# EAGLE schematic scoutfly_atmel (EAGLE 5.06)
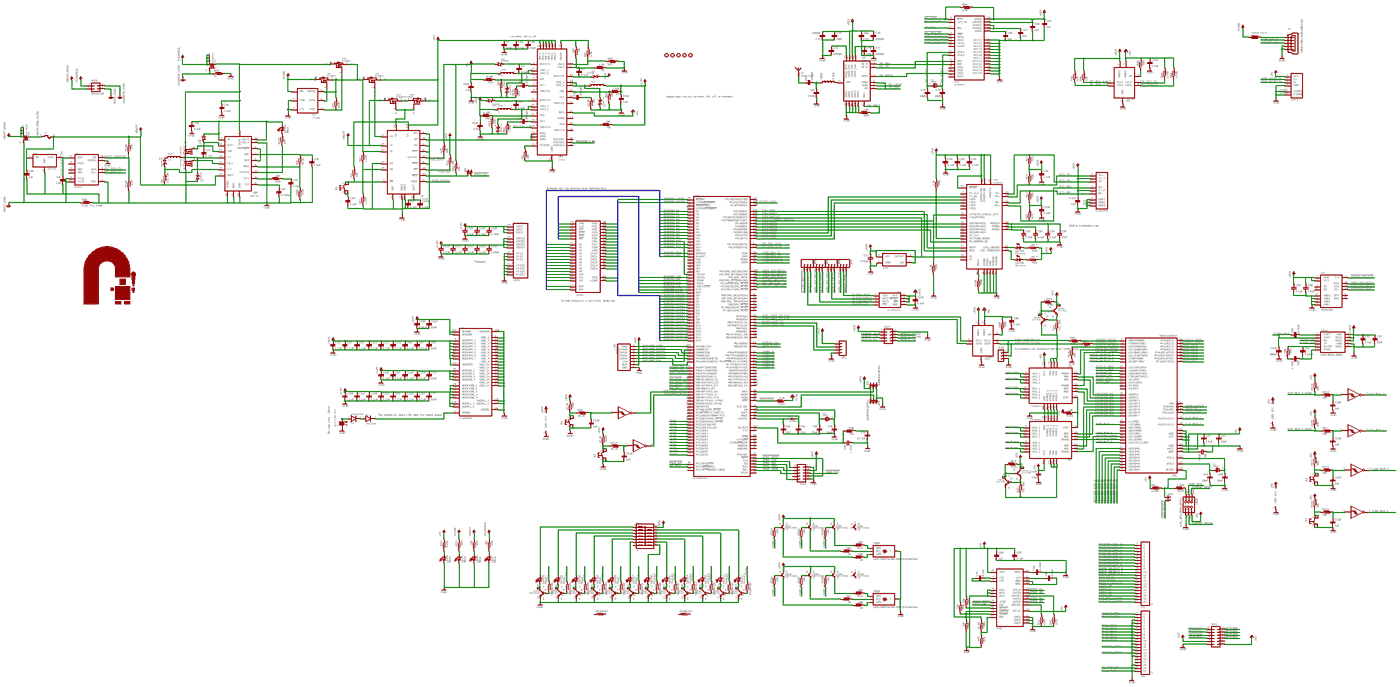
[diagram p0: schematic, sheet 1, overview]
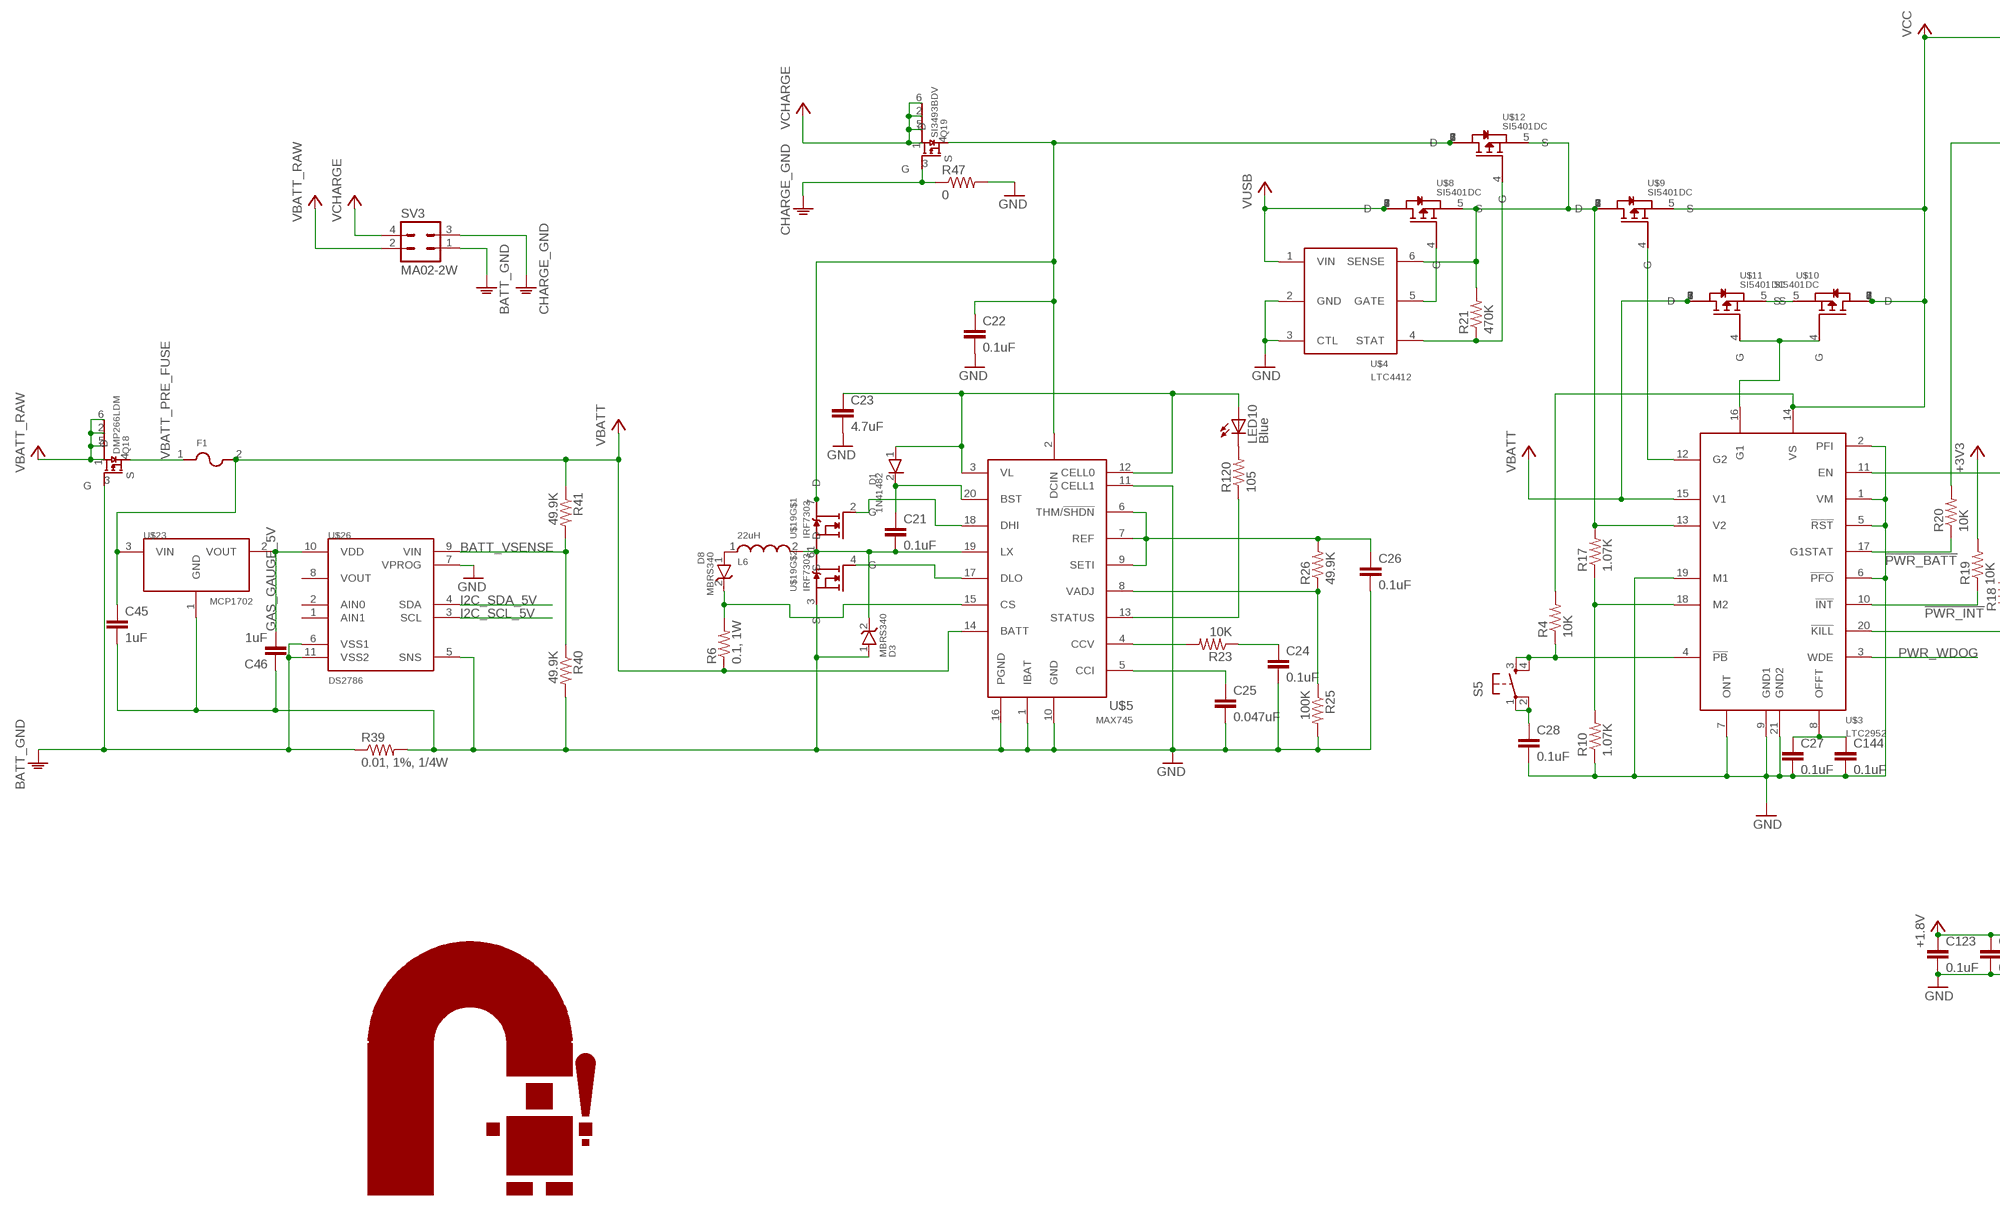
[diagram p1: schematic, sheet 1, part 1 of 6]
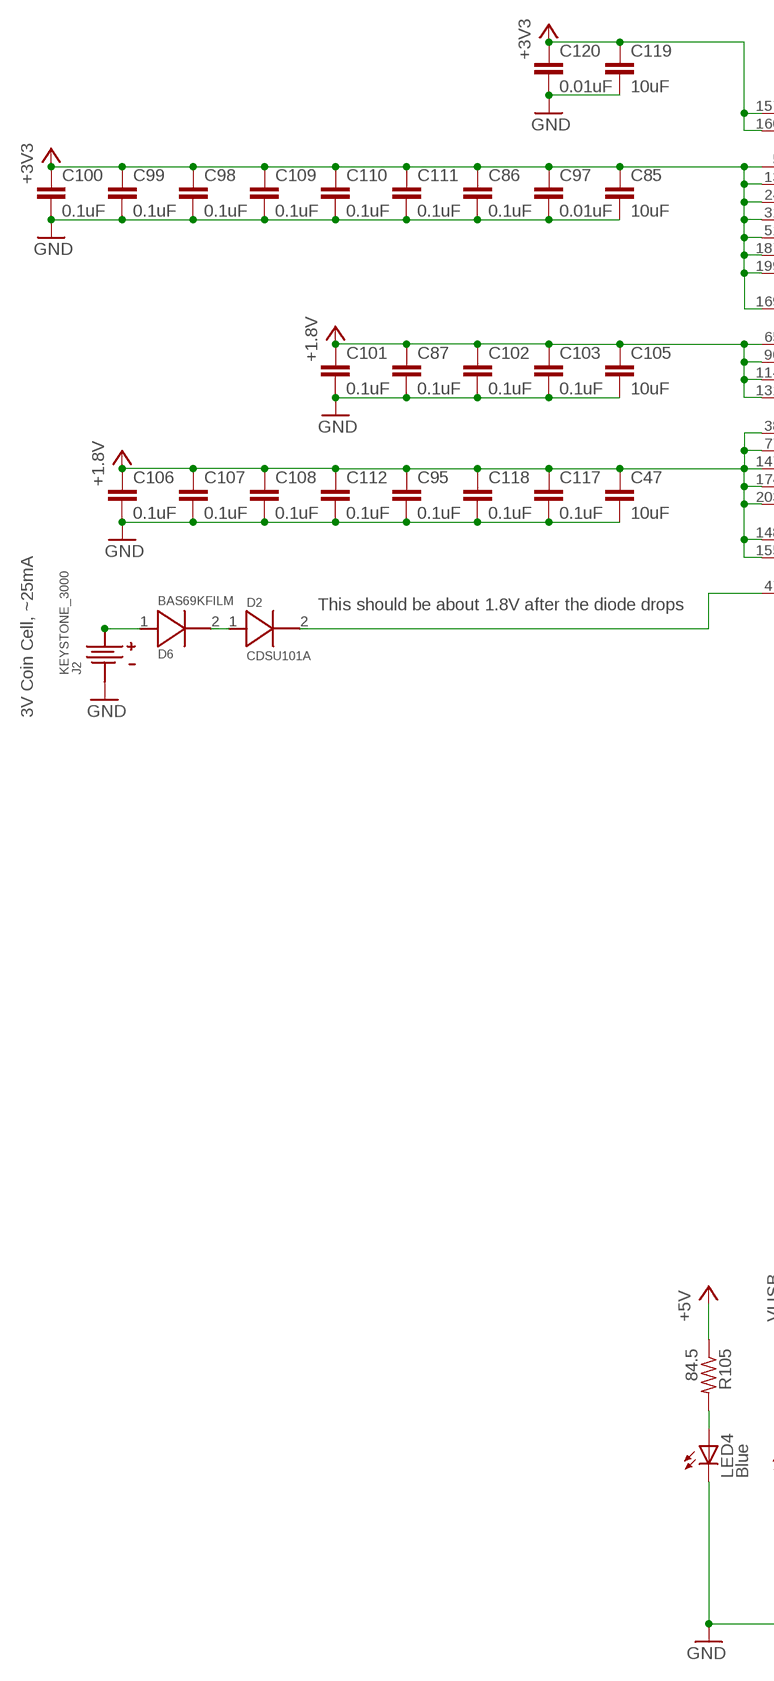
[diagram p2: schematic, sheet 1, part 2 of 6]
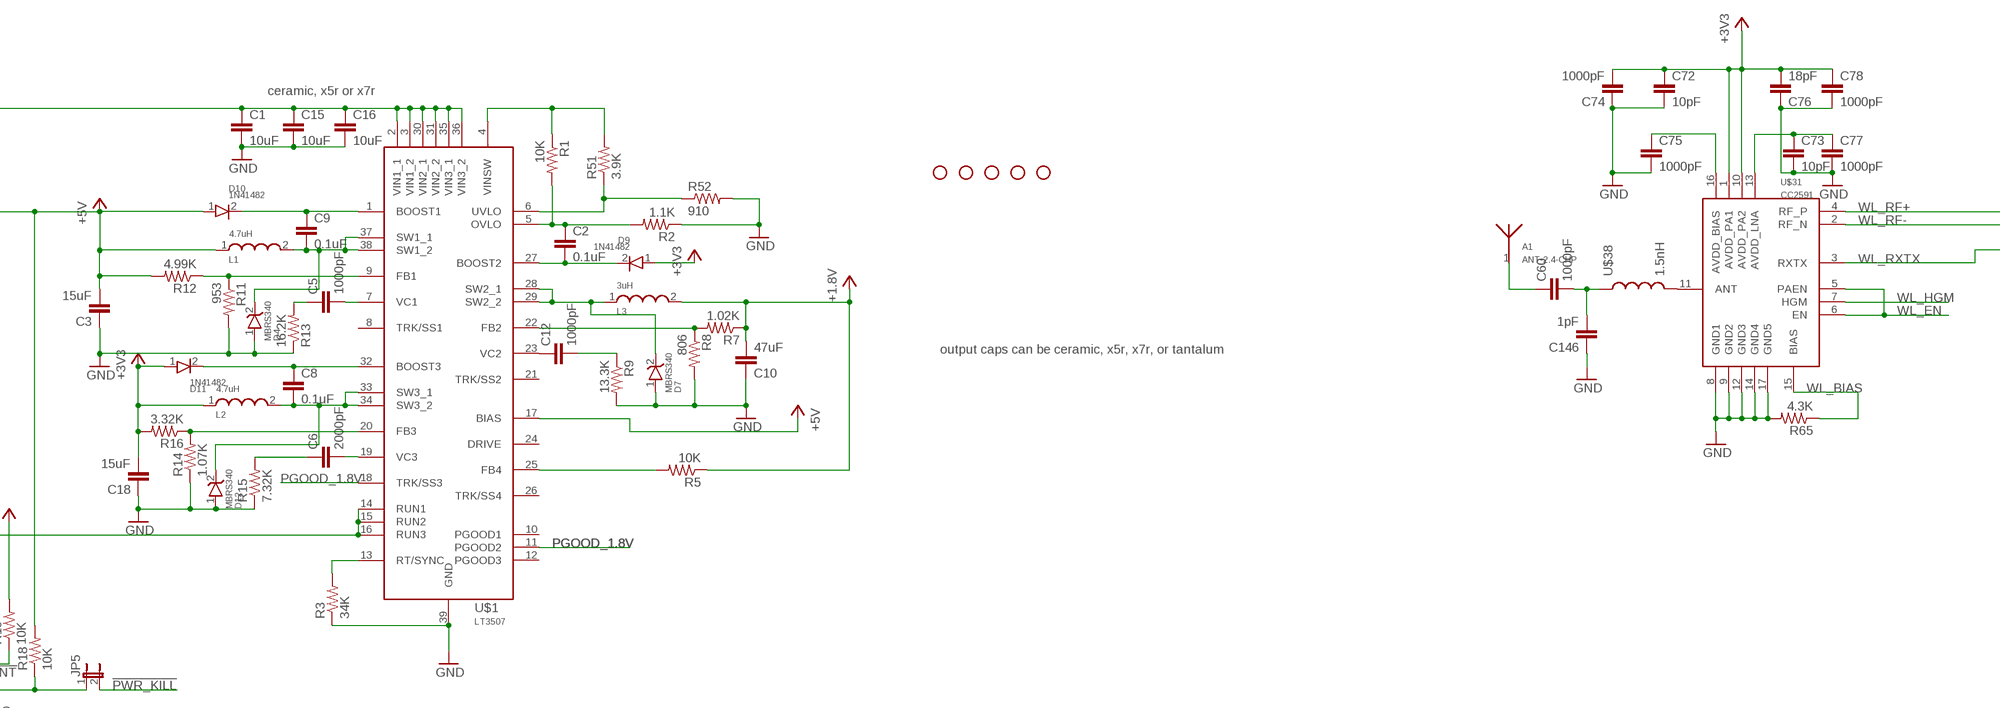
[diagram p3: schematic, sheet 1, part 3 of 6]
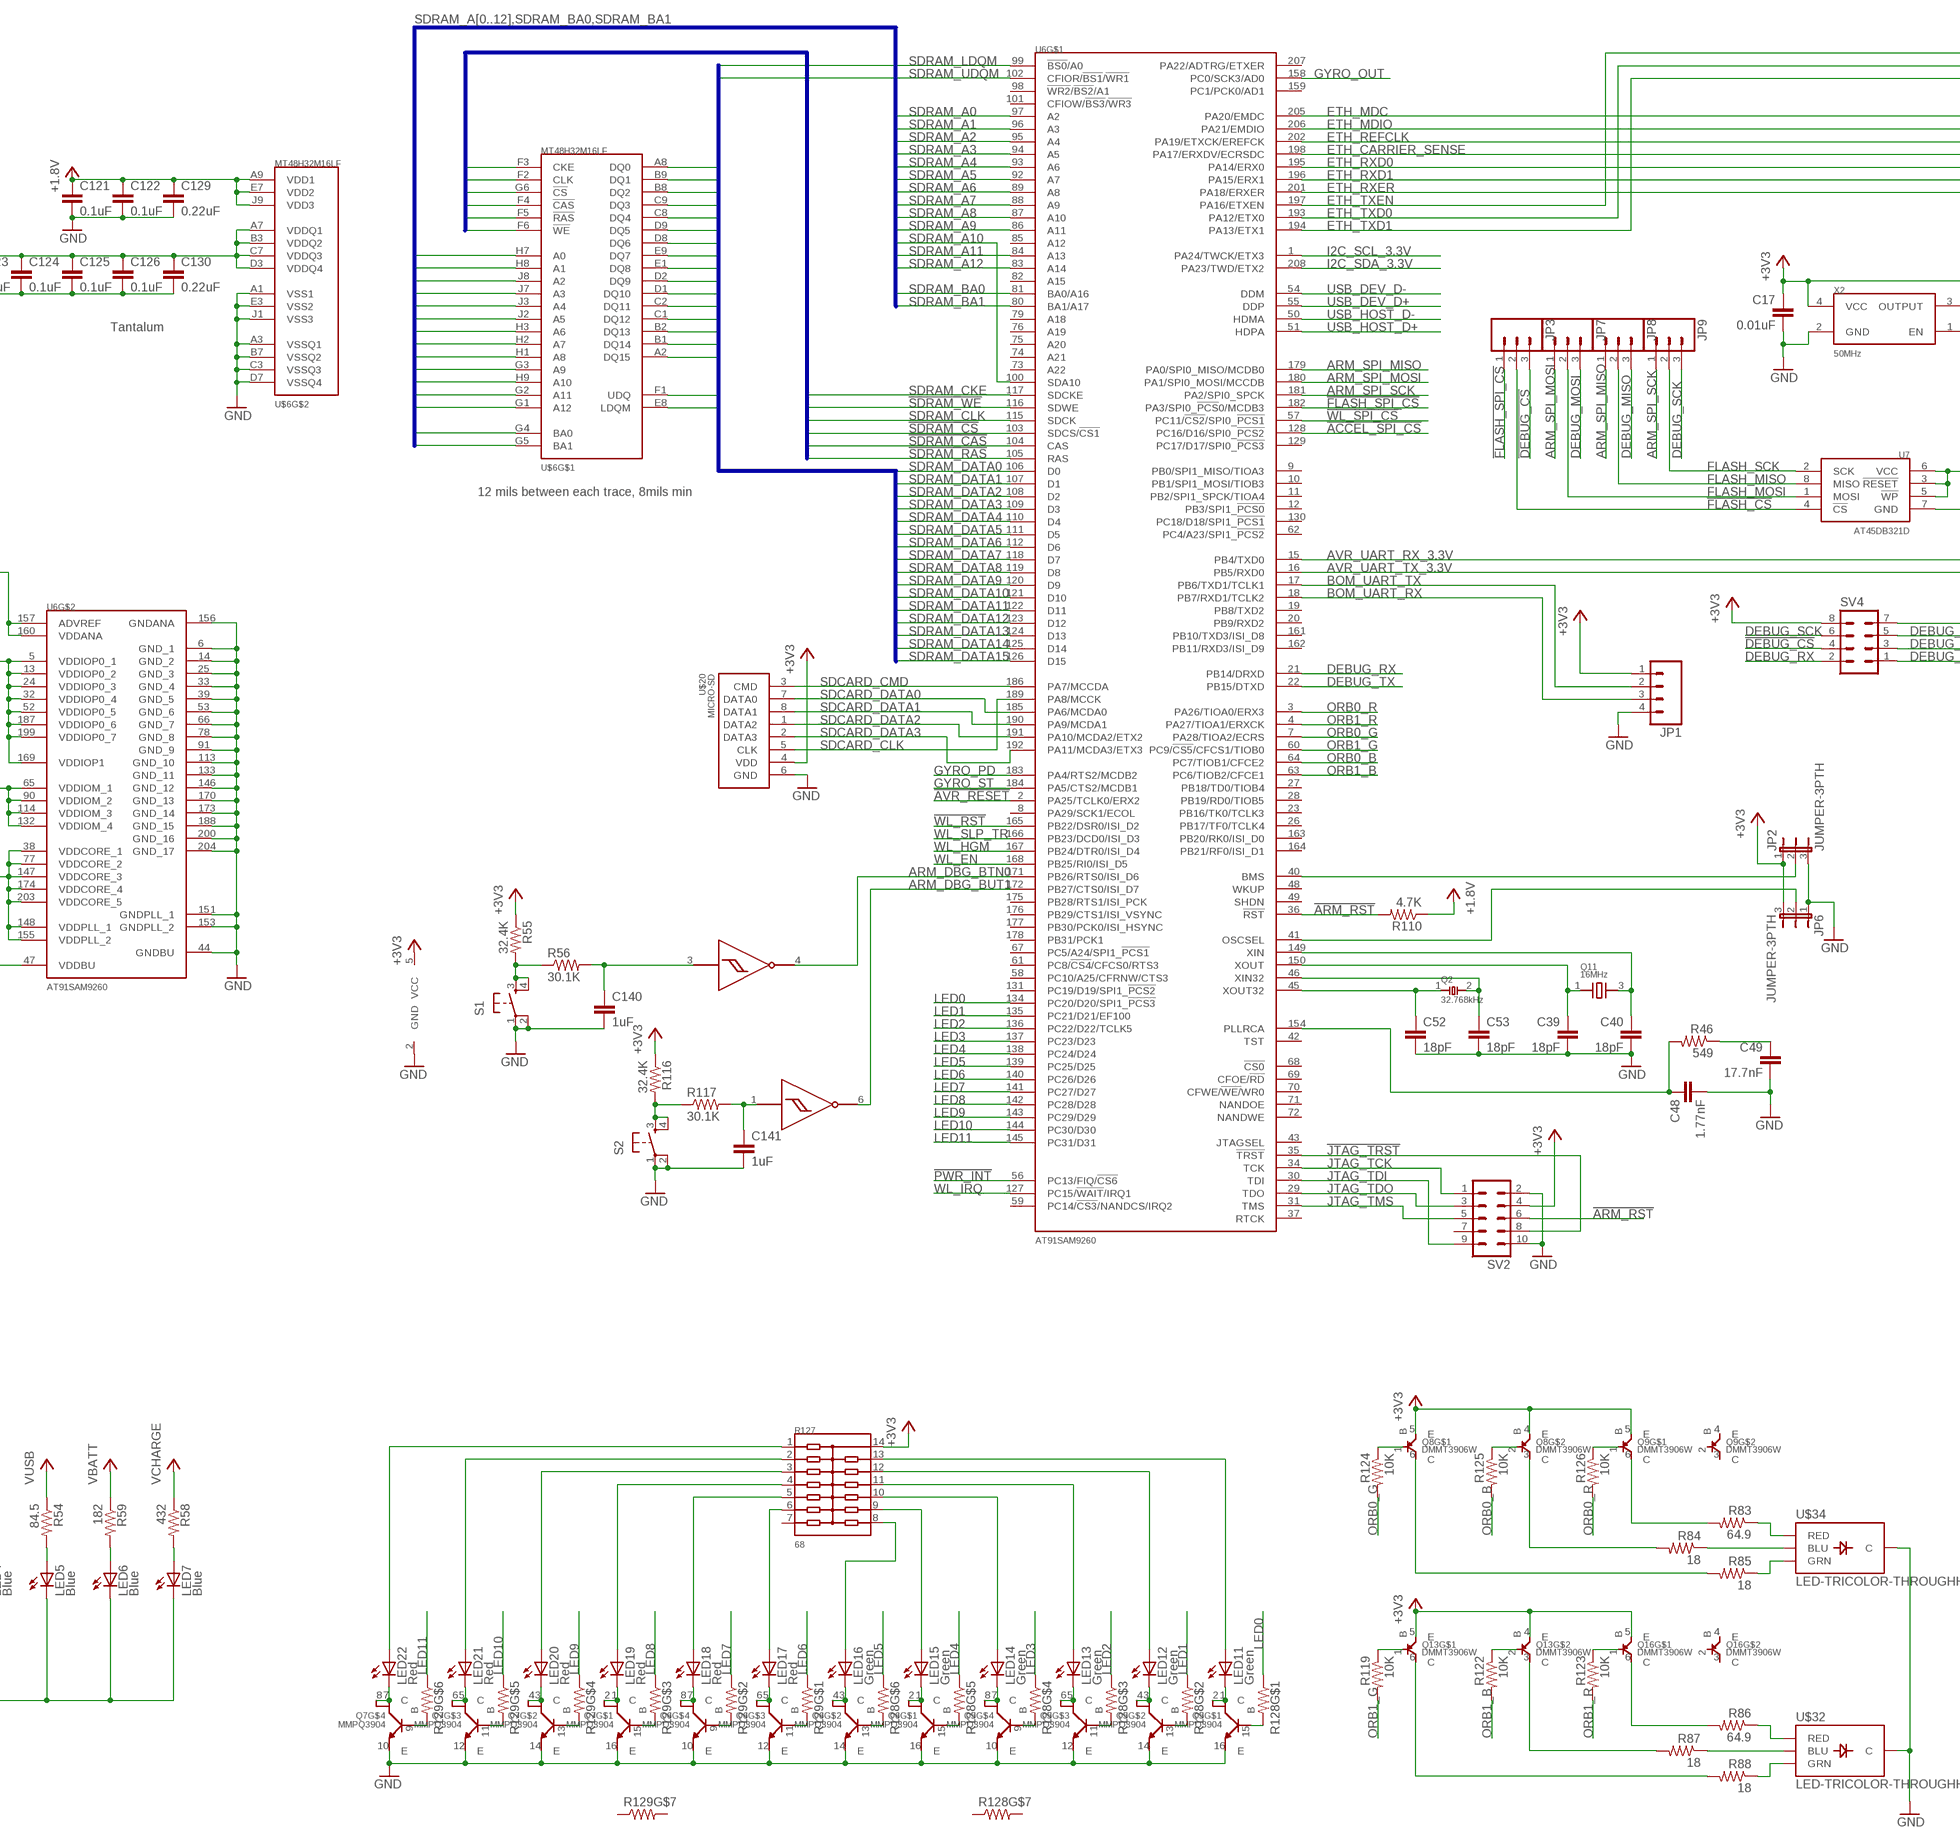
[diagram p4: schematic, sheet 1, part 4 of 6]
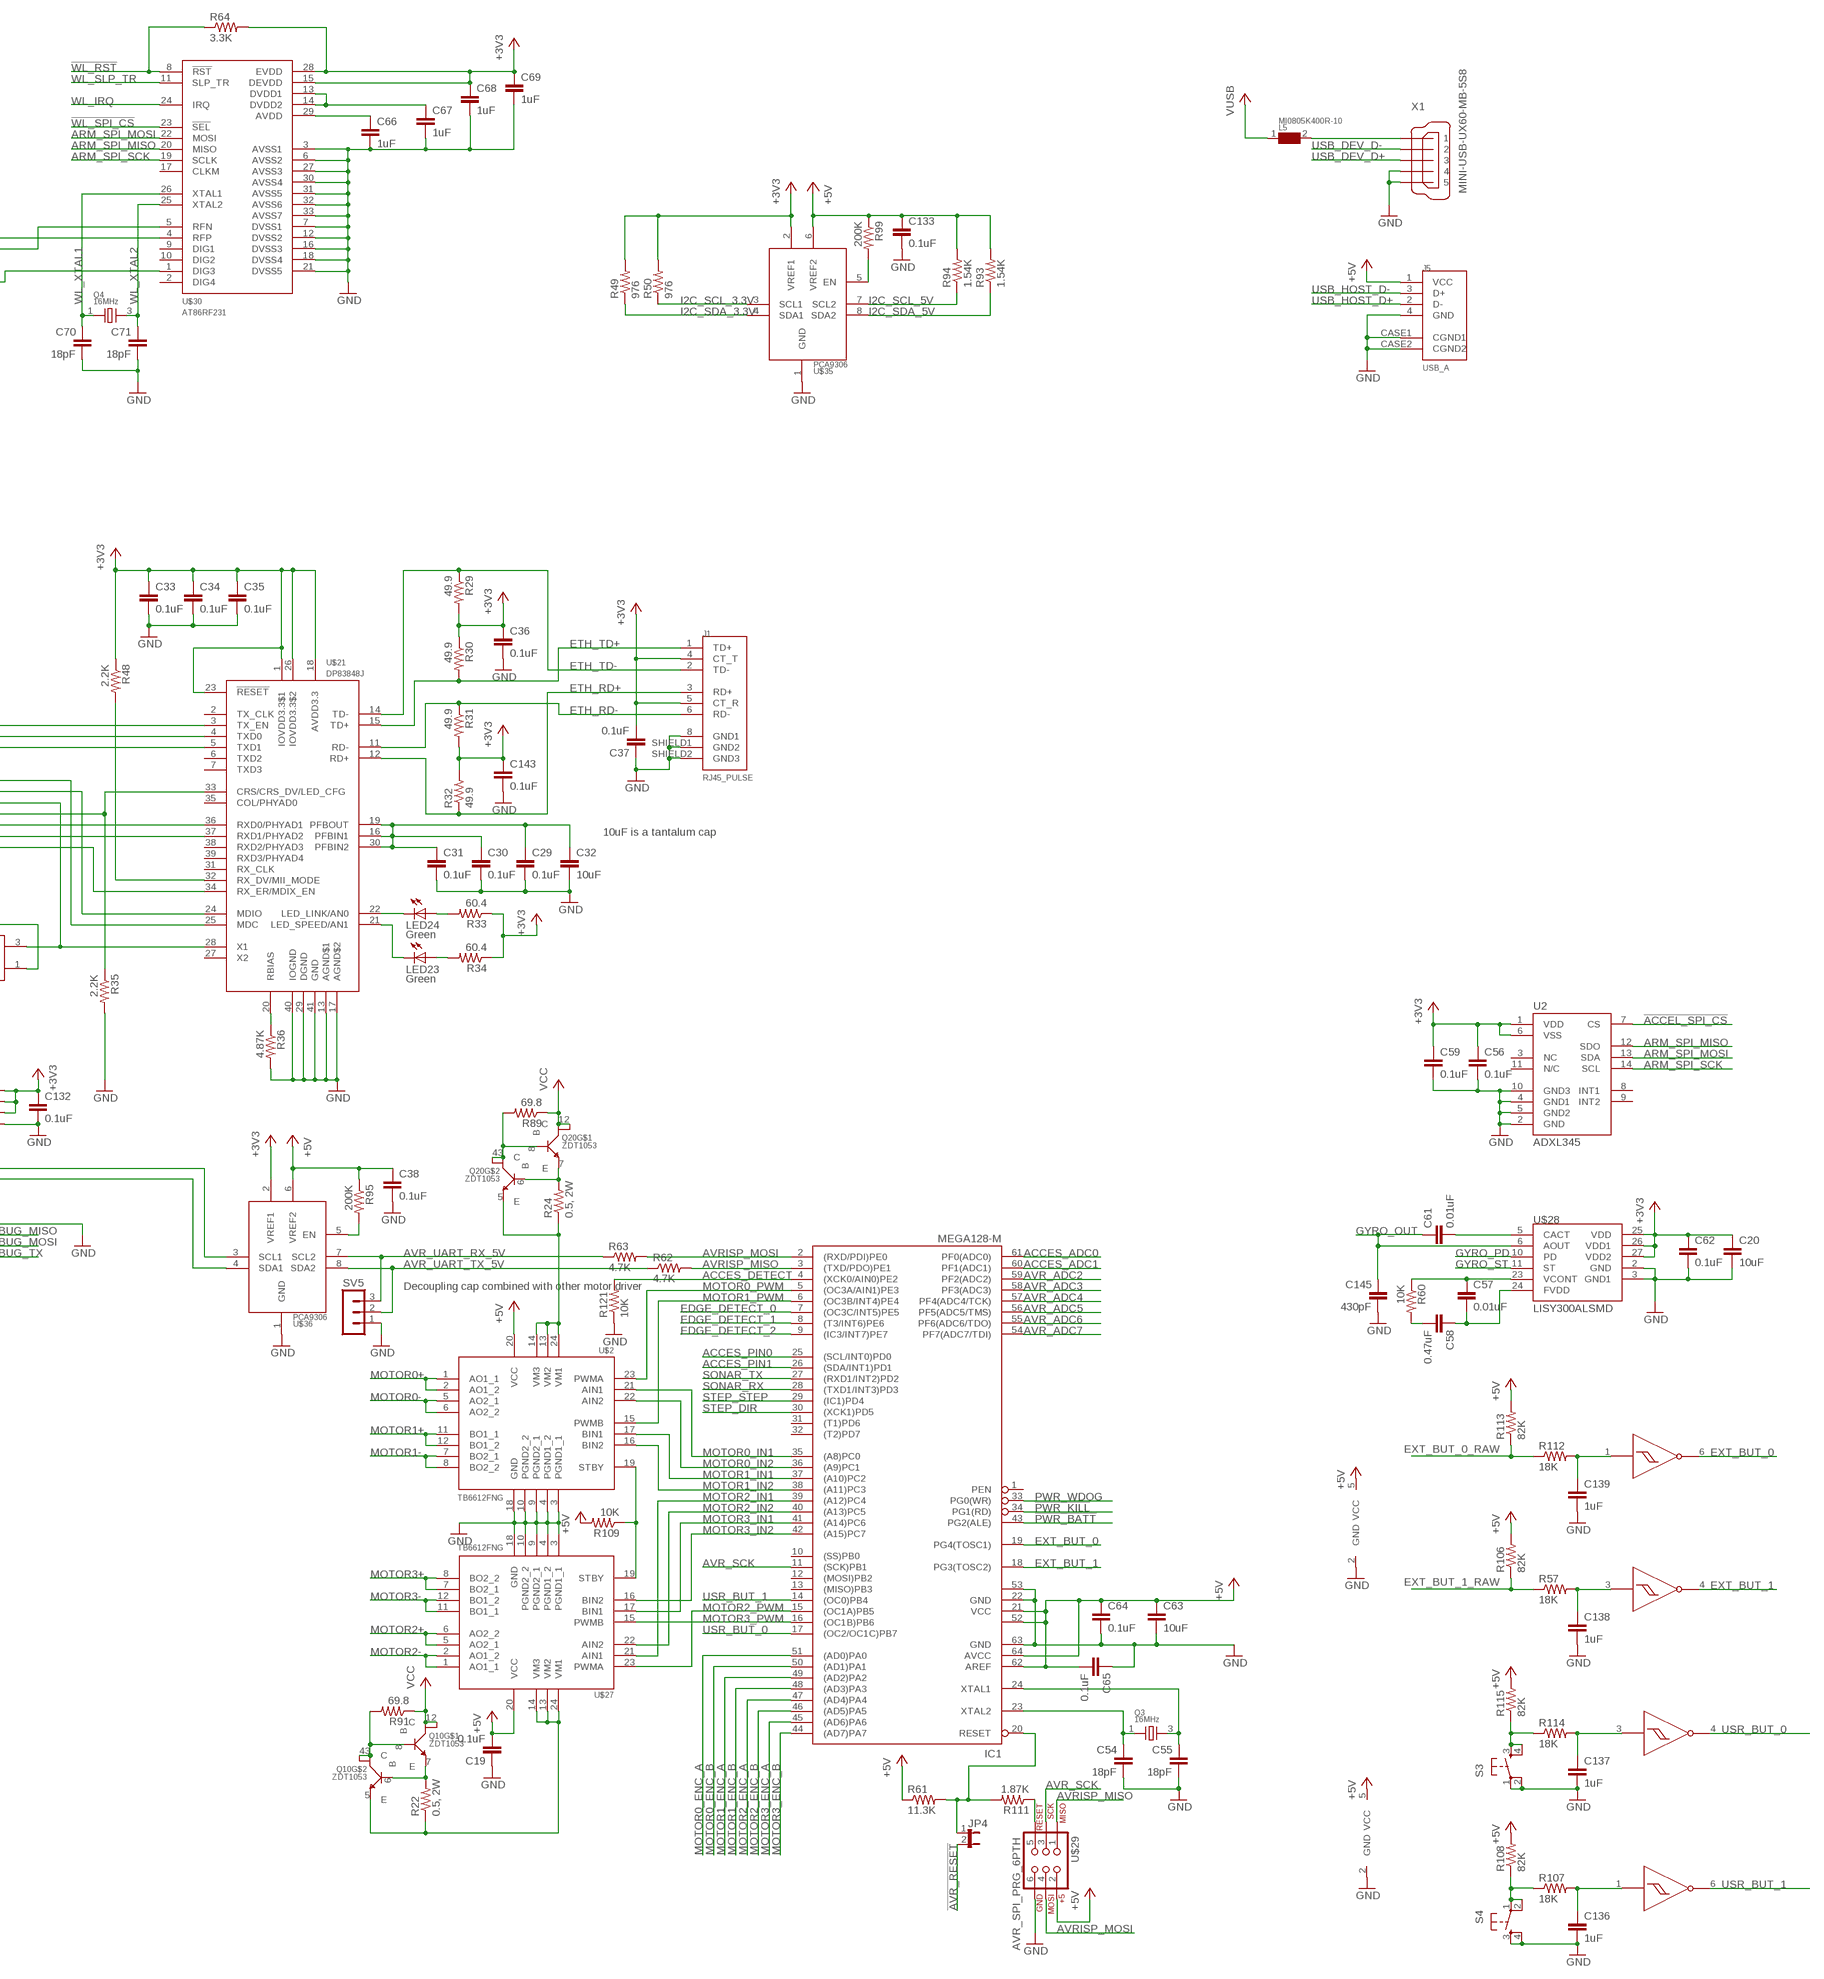
[diagram p5: schematic, sheet 1, part 5 of 6]
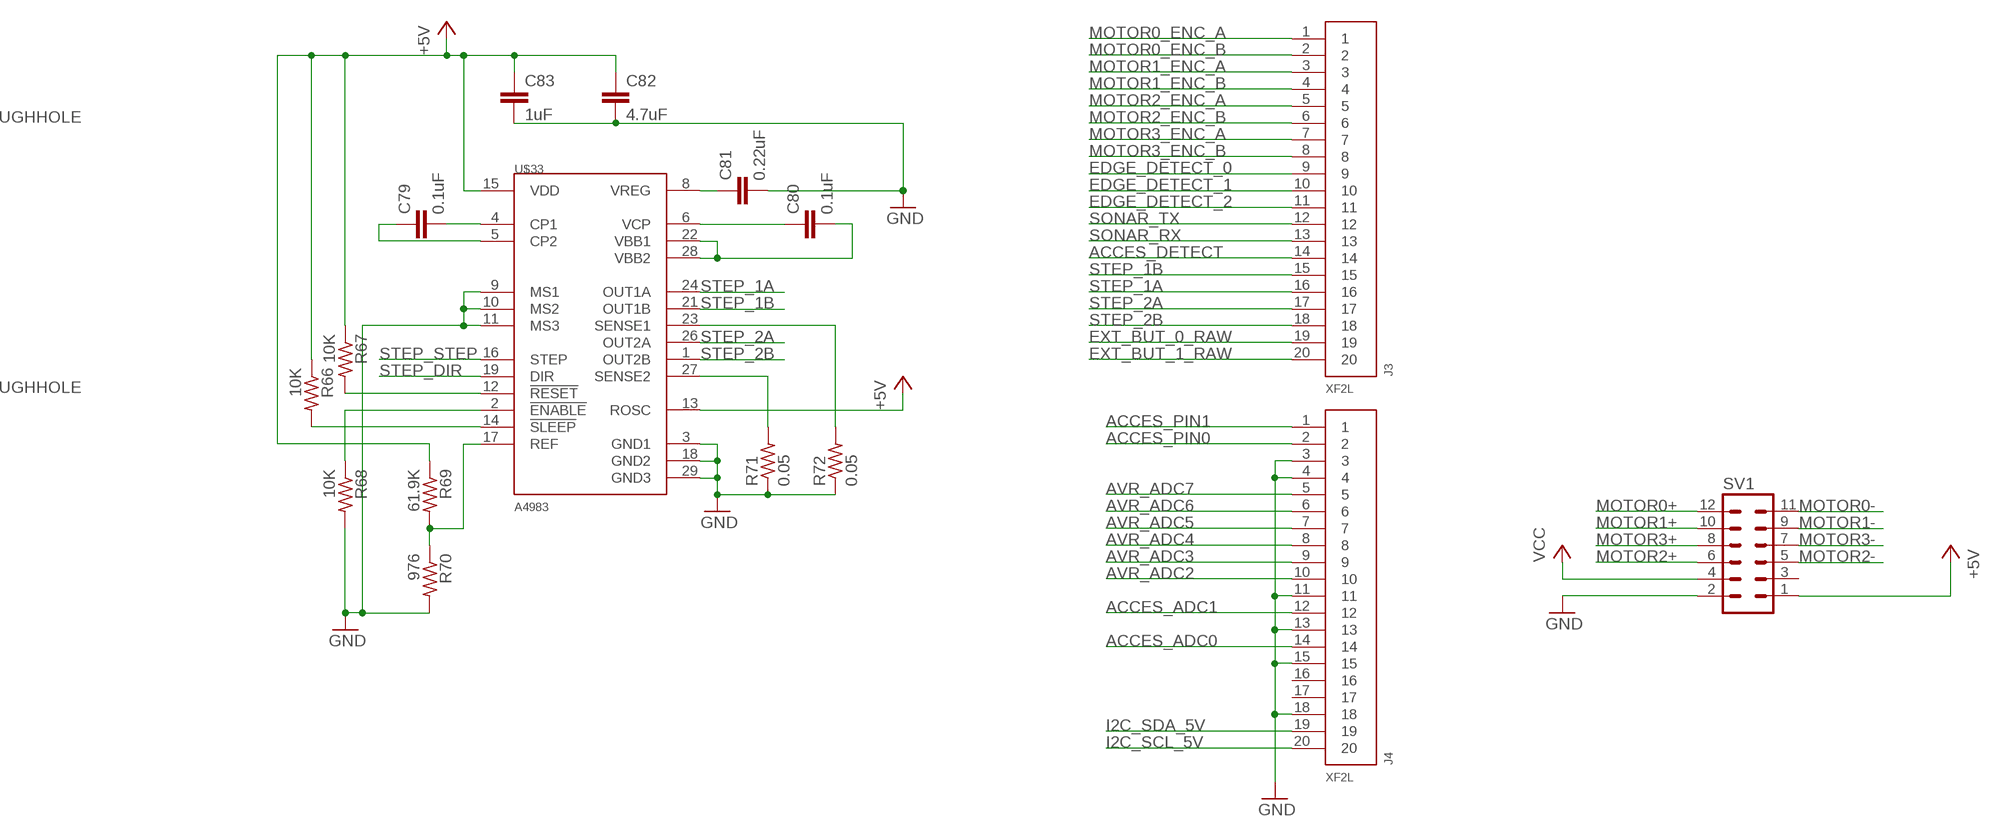
[diagram p6: schematic, sheet 1, part 6 of 6]

## Parts
A1  ANT-2.4-CHP  [CHIP_ANT_2.4GHZ]
C1  10uF  CAP0805  [0805]
C2  0.1uF  CAP0603-CAP  [0603-CAP]
C3  15uF  C-EUC1206  [C1206]
C5  1000pF  CAP0603-CAP  [0603-CAP]
C6  2000pF  CAP0603-CAP  [0603-CAP]
C8  0.1uF  CAP0603-CAP  [0603-CAP]
C9  0.1uF  CAP0603-CAP  [0603-CAP]
C10  47uF  C-EUC1206  [C1206]
C12  1000pF  CAP0603-CAP  [0603-CAP]
C15  10uF  CAP0805  [0805]
C16  10uF  CAP0805  [0805]
C17  0.01uF  CAP0603-CAP  [0603-CAP]
C18  15uF  C-EUC1206  [C1206]
C19  0.1uF  CAP0603-CAP  [0603-CAP]
C20  10uF  CAP0805  [0805]
C21  0.1uF  CAP0603-CAP  [0603-CAP]
C22  0.1uF  CAP0603-CAP  [0603-CAP]
C23  4.7uF  CAP0805  [0805]
C24  0.1uF  CAP0603-CAP  [0603-CAP]
C25  0.047uF  CAP0603-CAP  [0603-CAP]
C26  0.1uF  CAP0603-CAP  [0603-CAP]
C27  0.1uF  CAP0603-CAP  [0603-CAP]
C28  0.1uF  CAP0603-CAP  [0603-CAP]
C29  0.1uF  CAP0603-CAP  [0603-CAP]
C30  0.1uF  CAP0603-CAP  [0603-CAP]
C31  0.1uF  CAP0603-CAP  [0603-CAP]
C32  10uF  C-EUC1206  [C1206]
C33  0.1uF  CAP0603-CAP  [0603-CAP]
C34  0.1uF  CAP0603-CAP  [0603-CAP]
C35  0.1uF  CAP0603-CAP  [0603-CAP]
C36  0.1uF  CAP0603-CAP  [0603-CAP]
C37  0.1uF  CAP0603-CAP  [0603-CAP]
C38  0.1uF  CAP0603-CAP  [0603-CAP]
C39  18pF  CAP0603-CAP  [0603-CAP]
C40  18pF  CAP0603-CAP  [0603-CAP]
C45  1uF  CAP0603-CAP  [0603-CAP]
C46  1uF  CAP0603-CAP  [0603-CAP]
C47  10uF  CAP0805  [0805]
C48  1.77nF  C-EUC0805  [C0805]
C49  17.7nF  C-EUC0805  [C0805]
C52  18pF  CAP0603-CAP  [0603-CAP]
C53  18pF  CAP0603-CAP  [0603-CAP]
C54  18pF  CAP0603-CAP  [0603-CAP]
C55  18pF  CAP0603-CAP  [0603-CAP]
C56  0.1uF  CAP0603-CAP  [0603-CAP]
C57  0.01uF  CAP0603-CAP  [0603-CAP]
C58  0.47uF  CAP0603-CAP  [0603-CAP]
C59  0.1uF  CAP0603-CAP  [0603-CAP]
C60  1000pF  CAP0603-CAP  [0603-CAP]
C61  0.01uF  CAP0603-CAP  [0603-CAP]
C62  0.1uF  CAP0603-CAP  [0603-CAP]
C63  10uF  CAP0805  [0805]
C64  0.1uF  CAP0603-CAP  [0603-CAP]
C65  0.1uF  CAP0603-CAP  [0603-CAP]
C66  1uF  CAP0603-CAP  [0603-CAP]
C67  1uF  CAP0603-CAP  [0603-CAP]
C68  1uF  CAP0603-CAP  [0603-CAP]
C69  1uF  CAP0603-CAP  [0603-CAP]
C70  18pF  CAP0603-CAP  [0603-CAP]
C71  18pF  CAP0603-CAP  [0603-CAP]
C72  10pF  CAP0603-CAP  [0603-CAP]
C73  10pF  CAP0603-CAP  [0603-CAP]
C74  1000pF  CAP0603-CAP  [0603-CAP]
C75  1000pF  CAP0603-CAP  [0603-CAP]
C76  18pF  CAP0603-CAP  [0603-CAP]
C77  1000pF  CAP0603-CAP  [0603-CAP]
C78  1000pF  CAP0603-CAP  [0603-CAP]
C79  0.1uF  CAP0603-CAP  [0603-CAP]
C80  0.1uF  CAP0603-CAP  [0603-CAP]
C81  0.22uF  CAP0603-CAP  [0603-CAP]
C82  4.7uF  C-EUC0805  [C0805]
C83  1uF  CAP0603-CAP  [0603-CAP]
C85  10uF  CAP0805  [0805]
C86  0.1uF  CAP0603-CAP  [0603-CAP]
C87  0.1uF  CAP0603-CAP  [0603-CAP]
C95  0.1uF  CAP0603-CAP  [0603-CAP]
C97  0.01uF  CAP0603-CAP  [0603-CAP]
C98  0.1uF  CAP0603-CAP  [0603-CAP]
C99  0.1uF  CAP0603-CAP  [0603-CAP]
C100  0.1uF  CAP0603-CAP  [0603-CAP]
C101  0.1uF  CAP0603-CAP  [0603-CAP]
C102  0.1uF  CAP0603-CAP  [0603-CAP]
C103  0.1uF  CAP0603-CAP  [0603-CAP]
C105  10uF  CAP0805  [0805]
C106  0.1uF  CAP0603-CAP  [0603-CAP]
C107  0.1uF  CAP0603-CAP  [0603-CAP]
C108  0.1uF  CAP0603-CAP  [0603-CAP]
C109  0.1uF  CAP0603-CAP  [0603-CAP]
C110  0.1uF  CAP0603-CAP  [0603-CAP]
C111  0.1uF  CAP0603-CAP  [0603-CAP]
C112  0.1uF  CAP0603-CAP  [0603-CAP]
C117  0.1uF  CAP0603-CAP  [0603-CAP]
C118  0.1uF  CAP0603-CAP  [0603-CAP]
C119  10uF  CAP0805  [0805]
C120  0.01uF  CAP0603-CAP  [0603-CAP]
C121  0.1uF  C-EUC1206  [C1206]
C122  0.1uF  C-EUC1206  [C1206]
C123  0.1uF  C-EUC1206  [C1206]
C124  0.1uF  C-EUC1206  [C1206]
C125  0.1uF  C-EUC1206  [C1206]
C126  0.1uF  C-EUC1206  [C1206]
C129  0.22uF  C-EUC1206  [C1206]
C130  0.22uF  C-EUC1206  [C1206]
C132  0.1uF  CAP0603-CAP  [0603-CAP]
C133  0.1uF  CAP0603-CAP  [0603-CAP]
C136  1uF  CAP0603-CAP  [0603-CAP]
C137  1uF  CAP0603-CAP  [0603-CAP]
C138  1uF  CAP0603-CAP  [0603-CAP]
C139  1uF  CAP0603-CAP  [0603-CAP]
C140  1uF  CAP0603-CAP  [0603-CAP]
C141  1uF  CAP0603-CAP  [0603-CAP]
C143  0.1uF  CAP0603-CAP  [0603-CAP]
C144  0.1uF  CAP0603-CAP  [0603-CAP]
C145  430pF  CAP0603-CAP  [0603-CAP]
C146  1pF  CAP0603-CAP  [0603-CAP]
D1  1N41482  [SOD-123]
D2  CDSU101A  DIODE  [0603]
D3  MBRS340  [SMC/DO-214AB]
D4  MBRS340  [SMC/DO-214AB]
D6  BAS69KFILM  [SOD523]
D7  MBRS340  [SMC/DO-214AB]
D8  MBRS340  [SMC/DO-214AB]
D9  1N41482  [SOD-123]
D10  1N41482  [SOD-123]
D11  1N41482  [SOD-123]
D12  MBRS340  [SMC/DO-214AB]
F1  MF-SM200  [SM200]
IC1  MEGA128-M  [MLF64]
J1  RJ45_PULSE  [RJ45-PULSE]
J2  KEYSTONE_3000  [COIN_CELL]
J3  XF2L  [OMRON_XF]
J4  XF2L  [OMRON_XF]
J5  USB_A  [USB_A]
JP1  M04PTH  [1X04]
JP2  JUMPER-3PTH  [1X03]
JP3  M03PTH  [1X03]
JP4  JUMPER-2PTH  [1X02]
JP5  JUMPER-2PTH  [1X02]
JP6  JUMPER-3PTH  [1X03]
JP7  M03PTH  [1X03]
JP8  M03PTH  [1X03]
JP9  M03PTH  [1X03]
JP10  STAND-OFF  [STAND-OFF]
JP11  STAND-OFF  [STAND-OFF]
JP12  STAND-OFF  [STAND-OFF]
JP13  STAND-OFF  [STAND-OFF]
JP14  STAND-OFF  [STAND-OFF]
L1  4.7uH  DR74-XXX-R  [DR74]
L2  4.7uH  DR74-XXX-R  [DR74]
L3  3uH  NR6045TXXX  [NR6045]
L5  MI0805K400R-10  [0805]
L6  22uH  DR125-XXX-R  [DR125]
LED4  Blue  LED0603  [LED-0603]
LED5  Blue  LED0603  [LED-0603]
LED6  Blue  LED0603  [LED-0603]
LED7  Blue  LED0603  [LED-0603]
LED10  Blue  LED0603  [LED-0603]
LED11  Green  LED0603  [LED-0603]
LED12  Green  LED0603  [LED-0603]
LED13  Green  LED0603  [LED-0603]
LED14  Green  LED0603  [LED-0603]
LED15  Green  LED0603  [LED-0603]
LED16  Green  LED0603  [LED-0603]
LED17  Red  LED0603  [LED-0603]
LED18  Red  LED0603  [LED-0603]
LED19  Red  LED0603  [LED-0603]
LED20  Red  LED0603  [LED-0603]
LED21  Red  LED0603  [LED-0603]
LED22  Red  LED0603  [LED-0603]
LED23  Green  LED0603  [LED-0603]
LED24  Green  LED0603  [LED-0603]
Q2  32.768kHz  ECX-31B  [ECX-31B]
Q3  16MHz  NX3225SA  [NX3225SA]
Q4  16MHz  NX3225SA  [NX3225SA]
Q5  MMPQ3904  [16-SOIC]
Q6  MMPQ3904  [16-SOIC]
Q7  MMPQ3904  [16-SOIC]
Q8  DMMT3906W  [SOT363]
Q9  DMMT3906W  [SOT363]
Q10  ZDT1053  [SOT223-8]
Q11  16MHz  NX3225SA  [NX3225SA]
Q13  DMMT3906W  [SOT363]
Q16  DMMT3906W  [SOT363]
Q18  DMP266LDM  [SOT26]
Q19  SI3493BDV  [6-TSOP]
Q20  ZDT1053  [SOT223-8]
R1  10K  R-US_R0603  [R0603]
R2  1.1K  R-US_R0603  [R0603]
R3  34K  R-US_R0603  [R0603]
R4  10K  R-US_R0603  [R0603]
R5  10K  R-US_R0603  [R0603]
R6  0.1, 1W  RESISTOR2010  [R2010]
R7  1.02K  R-US_R0603  [R0603]
R8  806  R-US_R0603  [R0603]
R9  13.3K  R-US_R0603  [R0603]
R10  1.07K  R-US_R0603  [R0603]
R11  953  R-US_R0603  [R0603]
R12  4.99K  R-US_R0603  [R0603]
R13  16.2K  R-US_R0603  [R0603]
R14  1.07K  R-US_R0603  [R0603]
R15  7.32K  R-US_R0603  [R0603]
R16  3.32K  R-US_R0603  [R0603]
R17  1.07K  R-US_R0603  [R0603]
R18  10K  R-US_R0603  [R0603]
R19  10K  R-US_R0603  [R0603]
R20  10K  R-US_R0603  [R0603]
R21  470K  R-US_R0603  [R0603]
R22  0.5, 2W  R-US_R2512  [R2512]
R23  10K  R-US_R0603  [R0603]
R24  0.5, 2W  R-US_R2512  [R2512]
R25  100K  R-US_R0603  [R0603]
R26  49.9K  R-US_R0603  [R0603]
R29  49.9  R-US_R0603  [R0603]
R30  49.9  R-US_R0603  [R0603]
R31  49.9  R-US_R0603  [R0603]
R32  49.9  R-US_R0603  [R0603]
R33  60.4  R-US_R0603  [R0603]
R34  60.4  R-US_R0603  [R0603]
R35  2.2K  R-US_R0603  [R0603]
R36  4.87K  R-US_R0603  [R0603]
R39  0.01, 1%, 1/4W  RESISTOR  [0805]
R40  49.9K  R-US_R0603  [R0603]
R41  49.9K  R-US_R0603  [R0603]
R46  549  R-US_R0603  [R0603]
R47  0  R-US_R0603  [R0603]
R48  2.2K  R-US_R0603  [R0603]
R49  976  R-US_R0603  [R0603]
R50  976  R-US_R0603  [R0603]
R51  3.9K  R-US_R0603  [R0603]
R52  910  R-US_R0603  [R0603]
R54  84.5  R-US_R0603  [R0603]
R55  32.4K  R-US_R0603  [R0603]
R56  30.1K  R-US_R0603  [R0603]
R57  18K  R-US_R0603  [R0603]
R58  432  R-US_R0603  [R0603]
R59  182  R-US_R0603  [R0603]
R60  10K  R-US_R0603  [R0603]
R61  11.3K  R-US_R0603  [R0603]
R62  4.7K  R-US_R0603  [R0603]
R63  4.7K  R-US_R0603  [R0603]
R64  3.3K  R-US_R0603  [R0603]
R65  4.3K  R-US_R0603  [R0603]
R66  10K  R-US_R0603  [R0603]
R67  10K  R-US_R0603  [R0603]
R68  10K  R-US_R0603  [R0603]
R69  61.9K  R-US_R0603  [R0603]
R70  976  R-US_R0603  [R0603]
R71  0.05  R-US_R0603  [R0603]
R72  0.05  R-US_R0603  [R0603]
R83  64.9  R-US_R0603  [R0603]
R84  18  R-US_R0603  [R0603]
R85  18  R-US_R0603  [R0603]
R86  64.9  R-US_R0603  [R0603]
R87  18  R-US_R0603  [R0603]
R88  18  R-US_R0603  [R0603]
R89  69.8  R-US_R0603  [R0603]
R91  69.8  R-US_R0603  [R0603]
R93  1.54K  R-US_R0603  [R0603]
R94  1.54K  R-US_R0603  [R0603]
R95  200K  R-US_R0603  [R0603]
R99  200K  R-US_R0603  [R0603]
R105  84.5  R-US_R0603  [R0603]
R106  82K  R-US_R0603  [R0603]
R107  18K  R-US_R0603  [R0603]
R108  82K  R-US_R0603  [R0603]
R109  10K  R-US_R0603  [R0603]
R110  4.7K  R-US_R0603  [R0603]
R111  1.87K  R-US_R0603  [R0603]
R112  18K  R-US_R0603  [R0603]
R113  82K  R-US_R0603  [R0603]
R114  18K  R-US_R0603  [R0603]
R115  82K  R-US_R0603  [R0603]
R116  32.4K  R-US_R0603  [R0603]
R117  30.1K  R-US_R0603  [R0603]
R119  10K  R-US_R0603  [R0603]
R120  105  R-US_R0603  [R0603]
R121  10K  R-US_R0603  [R0603]
R122  10K  R-US_R0603  [R0603]
R123  10K  R-US_R0603  [R0603]
R124  10K  R-US_R0603  [R0603]
R125  10K  R-US_R0603  [R0603]
R126  10K  R-US_R0603  [R0603]
R127  68  RESNET_BUS_13  [14-SOIC_CTS]
R128  RESNET_ISO_7  [14-SOIC_CTS]
R129  RESNET_ISO_7  [14-SOIC_CTS]
S1  TAC_SWITCHSMD  [TACTILE_SWITCH_SMD]
S2  TAC_SWITCHSMD  [TACTILE_SWITCH_SMD]
S3  TAC_SWITCHSMD  [TACTILE_SWITCH_SMD]
S4  TAC_SWITCHSMD  [TACTILE_SWITCH_SMD]
S5  TAC_SWITCHSMD  [TACTILE_SWITCH_SMD]
SV1  MA06-2W  [MA06-2W]
SV2  MA05-2  [MA05-2]
SV3  MA02-2W  [MA02-2W]
SV4  MA04-2  [MA04-2]
SV5  MA03-1  [MA03-1]
U2  ADXL345  [LGA14]
U3  NL27WZ14  [SOT363]
U4  NL27WZ14  [SOT363]
U5  NL27WZ14  [SOT363]
U6  AT91SAM9260  [208-PQFP]
U7  AT45DB321D  [8-SOIC]
U$1  LT3507  [38-QFN]
U$2  TB6612FNG  [24-SSOP]
U$3  LTC2952  [20-QFN]
U$4  LTC4412  [6-TSOT23]
U$5  MAX745  [20-SSOP]
U$6  MT48H32M16LF  [54-VFBGA]
U$7  ROBOLOGOSILKSCREEN  [RCLOGO]
U$8  SI5401DC  [1206-8_CHIPFET]
U$9  SI5401DC  [1206-8_CHIPFET]
U$10  SI5401DC  [1206-8_CHIPFET]
U$11  SI5401DC  [1206-8_CHIPFET]
U$12  SI5401DC  [1206-8_CHIPFET]
U$19  IRF7303  [8-SOIC]
U$20  MICRO-SD  [MICRO_SD]
U$21  DP83848J  [40-LLP]
U$23  MCP1702  [SOT23]
U$26  DS2786  [10-TDFN]
U$27  TB6612FNG  [24-SSOP]
U$28  LISY300ALSMD  [LGA28]
U$29  AVR_SPI_PRG_6PTH  [2X3]
U$30  AT86RF231  [32-QFN]
U$31  CC2591  [16-QFN]
U$32  LED-TRICOLOR-THROUGHHOLE  [LED-TRICOLOR-THROUGHHOLE]
U$33  A4983  [28-QFN]
U$34  LED-TRICOLOR-THROUGHHOLE  [LED-TRICOLOR-THROUGHHOLE]
U$35  PCA9306  [TSSOP8]
U$36  PCA9306  [TSSOP8]
U$38  1.5nH  INDUCTOR0603  [0603]
X1  MINI-USB-UX60-MB-5S8  [UX60-MB-5S8]
X2  50MHz  K25-3C  [K25-3C]

## Nets
3.3V: C17.1 C18.2 C20.1 C33.1 C34.1 C35.1 C36.1 C37.2 C56.1 C59.1 C62.1 C68.1 C69.1 C72.1 C74.2 C76.2 C78.1 C85.1 C86.1 C97.1 C98.1 C99.1 C100.1 C109.1 C110.1 C111.1 C119.1 C120.1 C132.1 C143.1 D9.1 D11.1 J1.4(CT_T) J1.5(CT_R) JP1.1 JP2.1 JP6.3 L2.1 Q8.4(E) Q8.5(E) Q9.5(E) Q13.4(E) Q13.5(E) Q16.5(E) R16.2 R19.2 R29.2 R30.1 R31.2 R32.2 R33.1 R34.1 R48.1 R49.2 R50.2 R55.1 R64.2 R116.1 R127.14 SV2.4 SV4.8 U2.1(VDD) U2.6(VSS) U5.5(VCC) U6.5(VDDIOP0_1) U6.13(VDDIOP0_2) U6.24(VDDIOP0_3) U6.32(VDDIOP0_4) U6.52(VDDIOP0_5) U6.157(ADVREF) U6.160(VDDANA) U6.169(VDDIOP1) U6.187(VDDIOP0_6) U6.199(VDDIOP0_7) U7.3(!RESET) U7.5(!WP) U7.6(VCC) U$20.4(VDD) U$21.1(IOVDD3.3$1) U$21.18(AVDD3.3) U$21.23(!RESET) U$21.26(IOVDD3.3$2) U$28.25(VDD) U$28.26(VDD1) U$28.27(VDD2) U$30.15(DEVDD) U$30.28(EVDD) U$31.1(AVDD_PA1) U$31.10(AVDD_PA2) U$35.2(VREF1) U$36.2(VREF1) X2.1(EN) X2.4(VCC) ; supply symbol labelled +3V3
!ACCEL_SPI_CS: U2.7(CS) U6.128(PC16/D16/SPI0_!PCS2)
!ARM_RST: R110.2 SV2.6 U6.36(!RST)
!AVR_RESET: JP4.2 U6.2(PA25/TCLK0/ERX2)
!DEBUG_CS: JP3.3 SV4.4
!FLASH_CS: JP3.2 U7.4(!CS)
!FLASH_SPI_CS: JP3.1 U6.182(PA3/SPI0_!PCS!0/MCDB3)
!JTAG_TRST: SV2.8 U6.35(!TRST)
!PWR_BATT: IC1.43(PG2(ALE)) R20.1 U$3.17(G1STAT)
!PWR_INT: R19.1 U6.56(PC13/FIQ/!CS6) U$3.10(!INT)
!PWR_KILL: IC1.34(PG1(RD)) JP5.2
!SDRAM_CAS: U6.104(CAS) U$6.F4(!CAS)
!SDRAM_CS: U6.103(SDCS/!CS1) U$6.G6(!CS)
!SDRAM_RAS: U6.105(RAS) U$6.F5(!RAS)
!SDRAM_WE: U6.116(SDWE) U$6.F6(!WE)
!VBATT: R17.2 R21.2 U$3.13(V2) U$4.6(SENSE) U$8.5(S) U$9.1(D) U$9.2(D$1) U$9.3(D$2) U$9.6(D$3) U$9.7(D$4) U$9.8(D$5) U$12.5(S)
!VBATT_GATE: U$3.12(G2) U$9.4(G)
!WL_RST: R64.1 U6.165(PB22/DSR0/ISI_D2) U$30.8(!RST)
!WL_SPI_CS: U6.57(PC11/!CS2!/SPI0_!PCS1) U$30.23(!SEL)
+1.8V: C10.2 C47.1 C87.1 C95.1 C101.1 C102.1 C103.1 C105.1 C106.1 C107.1 C108.1 C112.1 C117.1 C118.1 C121.1 C122.1 C123.1 C124.1 C125.1 C126.1 C129.1 C130.1 L3.2 R5.1 R7.1 R110.1 U6.38(VDDCORE_1) U6.65(VDDIOM_1) U6.77(VDDCORE_2) U6.90(VDDIOM_2) U6.114(VDDIOM_3) U6.132(VDDIOM_4) U6.147(VDDCORE_3) U6.148(VDDPLL_1) U6.155(VDDPLL_2) U6.174(VDDCORE_4) U6.203(VDDCORE_5) U$6.A7(VDDQ1) U$6.A9(VDD1) U$6.B3(VDDQ2) U$6.C7(VDDQ3) U$6.D3(VDDQ4) U$6.E7(VDD2) U$6.J9(VDD3)
+5V: C3.2 C19.2 C38.1 C63.1 C64.1 C65.2 C82.1 C83.1 C133.1 D10.1 IC1.21(VCC) IC1.52(VCC1) IC1.62(AREF) IC1.64(AVCC) J5.1(VCC) L1.1 R12.2 R18.2 R20.2 R61.1 R66.1 R67.1 R69.1 R93.2 R94.2 R95.1 R99.1 R105.1 R106.2 R108.2 R109.2 R113.2 R115.2 SV1.1 U3.5(VCC) U4.5(VCC) U$1.17(BIAS) U$2.20(VCC) U$27.20(VCC) U$29.2 U$33.13(ROSC) U$33.15(VDD) U$35.6(VREF2) U$36.6(VREF2)
ACCES_ADC0: IC1.61(PF0(ADC0)) J4.14
ACCES_ADC1: IC1.60(PF1(ADC1)) J4.12
ACCES_DETECT: IC1.4((XCK0/AIN0)PE2) J3.14 R121.2
ACCES_PIN0: IC1.25((SCL/INT0)PD0) J4.2
ACCES_PIN1: IC1.26((SDA/INT1)PD1) J4.1
ARM_DBG_BTN0: U5.4(Y) U6.171(PB26/RTS0/ISI_D6)
ARM_DBG_BUT1: U5.6(Y) U6.172(PB27/CTS0/ISI_D7)
ARM_SPI_MISO: JP8.1 U2.12(SDO) U6.179(PA0/SPI0_MISO/MCDB0) U$30.20(MISO)
ARM_SPI_MOSI: JP7.1 U2.13(SDA) U6.180(PA1/SPI0_MOSI/MCCDB) U$30.22(MOSI)
ARM_SPI_SCK: JP9.1 U2.14(SCL) U6.181(PA2/SPI0_SPCK) U$30.19(SCLK)
AVR_ADC2: IC1.59(PF2(ADC2)) J4.10
AVR_ADC3: IC1.58(PF3(ADC3)) J4.9
AVR_ADC4: IC1.57(PF4(ADC4/TCK)) J4.8
AVR_ADC5: IC1.56(PF5(ADC5/TMS)) J4.7
AVR_ADC6: IC1.55(PF6(ADC6/TDO)) J4.6
AVR_ADC7: IC1.54(PF7(ADC7/TDI)) J4.5
AVR_SCK: IC1.11((SCK)PB1) U$29.3
AVR_UART_RX_3.3V: U6.15(PB4/TXD0) U$36.3(SCL1)
AVR_UART_RX_5V: R63.1 SV5.3 U$36.7(SCL2)
AVR_UART_TX_3.3V: U6.16(PB5/RXD0) U$36.4(SDA1)
AVR_UART_TX_5V: R62.1 SV5.2 U$36.8(SDA2)
AVRISP_MISO: IC1.3((TXD/PDO)PE1) R62.2 U$29.1
AVRISP_MOSI: IC1.2((RXD/PDI)PE0) R63.2 U$29.4
BATT_GND: Q18.3(G) R39.1 SV3.1 U$26.6(VSS1) U$26.11(VSS2)
BATT_VSENSE: R40.1 R41.2 U$26.9(VIN)
BOM_UART_RX: JP1.3 U6.18(PB7/RXD1/TCLK2)
BOM_UART_TX: JP1.2 U6.17(PB6/TXD1/TCLK1)
CHARGE_GND: Q19.3(G) R47.1 SV3.3
DEBUG_MISO: JP8.3 SV4.5
DEBUG_MOSI: JP7.3 SV4.3
DEBUG_RX: SV4.2 U6.21(PB14/DRXD)
DEBUG_SCK: JP9.3 SV4.6
DEBUG_TX: SV4.1 U6.22(PB15/DTXD)
EDGE_DETECT_0: IC1.7((OC3C/INT5)PE5) J3.9
EDGE_DETECT_1: IC1.8((T3/INT6)PE6) J3.10
EDGE_DETECT_2: IC1.9((IC3/INT7)PE7) J3.11
ETH_CARRIER_SENSE: R35.1 U6.198(PA17/ERXDV/ECRSDC) U$21.33(CRS/CRS_DV/LED_CFG)
ETH_MDC: U6.205(PA20/EMDC) U$21.25(MDC)
ETH_MDIO: U6.206(PA21/EMDIO) U$21.24(MDIO)
ETH_RD+: J1.3(RD+) R32.1 U$21.12(RD+)
ETH_RD-: J1.6(RD-) R31.1 U$21.11(RD-)
ETH_REFCLK: U6.202(PA19/ETXCK/EREFCK) U$21.28(X1) X2.3(OUTPUT)
ETH_RXD0: U6.195(PA14/ERX0) U$21.36(RXD0/PHYAD1)
ETH_RXD1: U6.196(PA15/ERX1) U$21.37(RXD1/PHYAD2)
ETH_RXER: U6.201(PA18/ERXER) U$21.34(RX_ER/MDIX_EN)
ETH_TD+: J1.1(TD+) R30.2 U$21.15(TD+)
ETH_TD-: J1.2(TD-) R29.1 U$21.14(TD-)
ETH_TXD0: U6.193(PA12/ETX0) U$21.4(TXD0)
ETH_TXD1: U6.194(PA13/ETX1) U$21.5(TXD1)
ETH_TXEN: U6.197(PA16/ETXEN) U$21.3(TX_EN)
EXT_BUT_0: IC1.19(PG4(TOSC1)) U3.6(Y)
EXT_BUT_0_RAW: J3.19 R112.1 R113.1
EXT_BUT_1: IC1.18(PG3(TOSC2)) U3.4(Y)
EXT_BUT_1_RAW: J3.20 R57.1 R106.1
FLASH_MISO: JP8.2 U7.8(MISO)
FLASH_MOSI: JP7.2 U7.1(MOSI)
FLASH_SCK: JP9.2 U7.2(SCK)
GAS_GAUGE_5V: C46.2 U$23.2(VOUT) U$26.10(VDD)
GND: C1.2 C3.1 C10.1 C15.2 C16.2 C17.2 C18.1 C19.1 C20.2 C22.2 C23.2 C24.2 C25.2 C26.2 C27.2 C28.2 C29.2 C30.2 C31.2 C32.2 C33.2 C34.2 C35.2 C36.2 C37.1 C38.2 C39.2 C40.2 C45.2 C46.1 C47.2 C48.2 C49.2 C52.2 C53.2 C54.2 C55.2 C56.2 C59.2 C62.2 C63.2 C64.2 C65.1 C66.2 C67.2 C68.2 C69.2 C70.2 C71.2 C72.2 C73.2 C74.1 C75.2 C76.1 C77.2 C78.2 C81.2 C82.2 C83.2 C85.2 C86.2 C87.2 C95.2 C97.2 C98.2 C99.2 C100.2 C101.2 C102.2 C103.2 C105.2 C106.2 C107.2 C108.2 C109.2 C110.2 C111.2 C112.2 C117.2 C118.2 C119.2 C120.2 C121.2 C122.2 C123.2 C124.2 C125.2 C126.2 C129.2 C130.2 C132.2 C133.2 C136.2 C137.2 C138.2 C139.2 C140.2 C141.2 C143.2 C144.2 C145.2 C146.1 D3.1 D4.1 D7.1 D12.1 IC1.22(GND) IC1.53(GND1) IC1.63(GND) J1.8(GND1) J1.SHIELD1(GND2) J1.SHIELD2(GND3) J2.NEGATIVE(-) J4.3 J4.4 J4.11 J4.13 J4.15 J4.18 J5.4(GND) J5.CASE1(CGND1) J5.CASE2(CGND2) JP1.4 JP2.3 JP6.1 LED4.C LED5.C LED6.C LED7.C Q5.10(E) Q5.12(E) Q5.14(E) Q5.16(E) Q6.10(E) Q6.12(E) Q6.14(E) Q6.16(E) Q7.10(E) Q7.12(E) Q7.14(E) Q7.16(E) R2.1 R3.1 R8.2 R9.2 R10.1 R11.2 R13.1 R14.1 R15.1 R25.2 R35.2 R36.2 R39.2 R40.2 R47.2 R52.2 R65.2 R68.2 R70.2 R71.1 R72.1 R121.1 S1.1 S1.2 S2.1 S2.2 S3.1 S3.2 S4.3 S4.4 SV1.2 SV2.2 SV2.10 SV4.7 SV5.1 U2.2(GND) U2.4(GND1) U2.5(GND2) U2.10(GND3) U3.2(GND) U4.2(GND) U5.2(GND) U6.6(GND_1) U6.14(GND_2) U6.25(GND_3) U6.33(GND_4) U6.39(GND_5) U6.44(GNDBU) U6.53(GND_6) U6.66(GND_7) U6.78(GND_8) U6.91(GND_9) U6.113(GND_10) U6.133(GND_11) U6.146(GND_12) U6.151(GNDPLL_1) U6.153(GNDPLL_2) U6.156(GNDANA) U6.170(GND_13) U6.173(GND_14) U6.188(GND_15) U6.200(GND_16) U6.204(GND_17) U7.7(GND) U$1.39(GND) U$2.3(PGND1_1) U$2.4(PGND1_2) U$2.9(PGND2_1) U$2.10(PGND2_2) U$2.18(GND) U$3.1(VM) U$3.2(PFI) U$3.5(!RST) U$3.6(!PFO) U$3.7(ONT) U$3.9(GND1) U$3.19(M1) U$3.21(GND2) U$4.2(GND) U$4.3(CTL) U$5.1(IBAT) U$5.10(GND) U$5.11(CELL1) U$5.16(PGND) U$6.A1(VSS1) U$6.A3(VSSQ1) U$6.B7(VSSQ2) U$6.C3(VSSQ3) U$6.D7(VSSQ4) U$6.E3(VSS2) U$6.J1(VSS3) U$19.3(S) U$20.6(GND) U$21.13(AGND$1) U$21.17(AGND$2) U$21.29(DGND) U$21.40(IOGND) U$21.41(GND) U$23.1(GND) U$26.5(SNS) U$26.7(VPROG) U$27.3(PGND1_1) U$27.4(PGND1_2) U$27.9(PGND2_1) U$27.10(PGND2_2) U$27.18(GND) U$28.2(GND) U$28.3(GND1) U$29.6 U$30.3(AVSS1) U$30.6(AVSS2) U$30.7(DVSS1) U$30.12(DVSS2) U$30.16(DVSS3) U$30.18(DVSS4) U$30.21(DVSS5) U$30.27(AVSS3) U$30.30(AVSS4) U$30.31(AVSS5) U$30.32(AVSS6) U$30.33(AVSS7) U$31.8(GND1) U$31.9(GND2) U$31.12(GND3) U$31.14(GND4) U$31.17(GND5) U$32.GND(C) U$33.3(GND1) U$33.9(MS1) U$33.10(MS2) U$33.11(MS3) U$33.18(GND2) U$33.29(GND3) U$34.GND(C) U$35.1(GND) U$36.1(GND) X1.4 X1.5 X2.2(GND)
GYRO_OUT: C61.1 C145.1 U6.158(PC0/SCK3/AD0) U$28.6(AOUT)
GYRO_PD: U6.183(PA4/RTS2/MCDB2) U$28.10(PD)
GYRO_ST: U6.184(PA5/CTS2/MCDB1) U$28.11(ST)
I2C_SCL_3.3V: R50.1 U6.1(PA24/TWCK/ETX3) U$35.3(SCL1)
I2C_SCL_5V: J4.20 R94.1 U$26.3(SCL) U$35.7(SCL2)
I2C_SDA_3.3V: R49.1 U6.208(PA23/TWD/ETX2) U$35.4(SDA1)
I2C_SDA_5V: J4.19 R93.1 U$26.4(SDA) U$35.8(SDA2)
JTAG_TCK: SV2.1 U6.34(TCK)
JTAG_TDI: SV2.9 U6.30(TDI)
JTAG_TDO: SV2.3 U6.29(TDO)
JTAG_TMS: SV2.5 U6.31(TMS)
LED0: R128.1 U6.134(PC20/D20/SPI1_!PCS3)
LED1: R128.2 U6.135(PC21/D21/EF100)
LED2: R128.3 U6.136(PC22/D22/TCLK5)
LED3: R128.4 U6.137(PC23/D23)
LED4: R128.5 U6.138(PC24/D24)
LED5: R128.6 U6.139(PC25/D25)
LED6: R129.1 U6.140(PC26/D26)
LED7: R129.2 U6.141(PC27/D27)
LED8: R129.3 U6.142(PC28/D28)
LED9: R129.4 U6.143(PC29/D29)
LED10: R129.5 U6.144(PC30/D30)
LED11: R129.6 U6.145(PC31/D31)
MOTOR0+: SV1.12 U$2.1(AO1_1) U$2.2(AO1_2)
MOTOR0-: SV1.11 U$2.5(AO2_1) U$2.6(AO2_2)
MOTOR0_ENC_A: IC1.51((AD0)PA0) J3.1
MOTOR0_ENC_B: IC1.50((AD1)PA1) J3.2
MOTOR0_IN1: IC1.35((A8)PC0) U$2.21(AIN1)
MOTOR0_IN2: IC1.36((A9)PC1) U$2.22(AIN2)
MOTOR0_PWM: IC1.5((OC3A/AIN1)PE3) U$2.23(PWMA)
MOTOR1+: SV1.10 U$2.11(BO1_1) U$2.12(BO1_2)
MOTOR1-: SV1.9 U$2.7(BO2_1) U$2.8(BO2_2)
MOTOR1_ENC_A: IC1.49((AD2)PA2) J3.3
MOTOR1_ENC_B: IC1.48((AD3)PA3) J3.4
MOTOR1_IN1: IC1.37((A10)PC2) U$2.17(BIN1)
MOTOR1_IN2: IC1.38((A11)PC3) U$2.16(BIN2)
MOTOR1_PWM: IC1.6((OC3B/INT4)PE4) U$2.15(PWMB)
MOTOR2+: SV1.6 U$27.5(AO2_1) U$27.6(AO2_2)
MOTOR2-: SV1.5 U$27.1(AO1_1) U$27.2(AO1_2)
MOTOR2_ENC_A: IC1.47((AD4)PA4) J3.5
MOTOR2_ENC_B: IC1.46((AD5)PA5) J3.6
MOTOR2_IN1: IC1.39((A12)PC4) U$27.21(AIN1)
MOTOR2_IN2: IC1.40((A13)PC5) U$27.22(AIN2)
MOTOR2_PWM: IC1.15((OC1A)PB5) U$27.23(PWMA)
MOTOR3+: SV1.8 U$27.7(BO2_1) U$27.8(BO2_2)
MOTOR3-: SV1.7 U$27.11(BO1_1) U$27.12(BO1_2)
MOTOR3_ENC_A: IC1.45((AD6)PA6) J3.7
MOTOR3_ENC_B: IC1.44((AD7)PA7) J3.8
MOTOR3_IN1: IC1.41((A14)PC6) U$27.17(BIN1)
MOTOR3_IN2: IC1.42((A15)PC7) U$27.16(BIN2)
MOTOR3_PWM: IC1.16((OC1B)PB6) U$27.15(PWMB)
N$9: D2.2 U6.47(VDDBU)
N$11: Q8.1(B) R124.1
N$14: Q7.9(B) R129.9
N$20: LED22.C Q7.7(C) Q7.8(C1)
N$21: C5.1 R13.2
N$22: Q7.13(B) R129.11
N$23: C6.1 R15.2
N$24: C12.1 U$1.23(VC2)
N$25: C12.2 R9.1
N$26: LED20.C Q7.3(C) Q7.4(C1)
N$28: R48.2 U$21.32(RX_DV/MII_MODE)
N$29: C40.1 Q11.3 U6.149(XIN)
N$30: C39.1 Q11.1 U6.150(XOUT)
N$31: JP2.2 U6.40(BMS)
N$32: C48.1 R46.2 U6.154(PLLRCA)
N$33: JP6.2 U6.41(OSCSEL)
N$35: D2.1 D6.2
N$36: LED17.C Q6.5(C) Q6.6(C1)
N$37: LED16.C Q6.3(C) Q6.4(C1)
N$38: Q6.11(B) R129.14
N$39: Q6.13(B) R128.9
N$40: Q8.2(B) R125.1
N$41: Q9.1(B) R126.1
N$42: Q16.1(B) R123.1
N$43: Q13.2(B) R122.1
N$44: Q13.1(B) R119.1
N$49: R85.1 U$34.GRN
N$52: JP5.1 R18.1 U$3.20(!KILL)
N$53: IC1.20(RESET) JP4.1 R61.2 R111.2
N$73: R10.2 R17.1 U$3.18(M2)
N$77: U$10.5(S) U$11.5(S)
N$81: C21.1 D1.2 U$5.20(BST)
N$83: C21.2 D3.2 L6.2 U$5.19(LX) U$19.1(S) U$19.5($D1) U$19.6(D)
N$84: D8.1 L6.1
N$87: D8.2 R6.2 U$5.15(CS)
N$90: R23.2 U$5.4(CCV)
N$91: C24.1 R23.1
N$92: C25.1 U$5.5(CCI)
N$93: R25.1 R26.1 U$5.8(VADJ)
N$94: U$5.18(DHI) U$19.2(G)
N$95: C26.1 R26.2 U$5.6(THM/!SHDN) U$5.7(REF) U$5.9(SETI)
N$96: U$5.17(DLO) U$19.4(G)
N$97: C23.1 D1.1 LED10.A U$5.3(VL) U$5.12(CELL0)
N$121: C27.1 C144.1 U$3.8(OFFT)
N$122: C28.1 S5.1 S5.2
N$123: C29.1 C30.1 C31.1 C32.1 U$21.16(PFBIN1) U$21.19(PFBOUT) U$21.30(PFBIN2)
N$124: LED23.A R34.2
N$126: LED24.C U$21.22(LED_LINK/AN0)
N$129: LED23.C U$21.21(LED_SPEED/AN1)
N$132: LED24.A R33.2
N$133: R36.1 U$21.20(RBIAS)
N$142: L5.2 X1.1
N$145: C53.1 Q2.2 U6.46(XIN32)
N$146: LED22.A R127.1
N$149: LED21.A R127.2
N$150: LED20.A R127.3
N$151: LED19.A R127.4
N$152: LED18.A R127.5
N$153: LED17.A R127.6
N$154: LED16.A R127.8
N$155: LED15.A R127.9
N$156: LED14.A R127.10
N$158: C49.1 R46.1
N$159: C52.1 Q2.1 U6.45(XOUT32)
N$161: C55.1 IC1.24(XTAL1) Q3.3
N$162: C54.1 IC1.23(XTAL2) Q3.1
N$164: LED13.A R127.11
N$165: LED12.A R127.12
N$174: C138.1 R57.2 U3.3(X)
N$175: A1.1 C60.1
N$178: C66.1 U$30.29(AVDD)
N$179: C67.1 U$30.13(DVDD1) U$30.14(DVDD2)
N$182: C57.1 R60.1 U$28.23(VCONT)
N$183: C58.2 R60.2
N$184: C79.2 U$33.4(CP1)
N$185: C57.2 C58.1 U$28.24(FVDD)
N$186: C61.2 U$28.5(CACT)
N$187: C75.1 U$31.16(AVDD_BIAS)
N$190: C73.1 C77.1 U$31.13(AVDD_LNA)
N$191: C79.1 U$33.5(CP2)
N$192: C80.2 U$33.22(VBB1) U$33.28(VBB2)
N$193: C80.1 U$33.6(VCP)
N$194: R68.1 U$33.2(!ENABLE)
N$195: C81.1 U$33.8(VREG)
N$198: R69.2 R70.1 U$33.17(REF)
N$199: R66.2 U$33.14(!SLEEP)
N$200: LED11.A R127.13
N$201: R67.2 U$33.12(!RESET)
N$202: R72.2 U$33.23(SENSE1)
N$203: R71.2 U$33.27(SENSE2)
N$205: LED21.C Q7.5(C) Q7.6(C1)
N$206: R109.1 U$2.19(STBY) U$27.19(STBY)
N$208: LED19.C Q7.1(C) Q7.2(C1)
N$209: LED18.C Q6.7(C) Q6.8(C1)
N$210: R4.1 S5.3 S5.4 U$3.4(!PB)
N$213: LED15.C Q6.1(C) Q6.2(C1)
N$214: LED14.C Q5.7(C) Q5.8(C1)
N$215: LED13.C Q5.5(C) Q5.6(C1)
N$216: LED12.C Q5.3(C) Q5.4(C1)
N$217: LED11.C Q5.1(C) Q5.2(C1)
N$225: R84.1 U$34.BLU
N$226: R83.1 U$34.RED
N$227: Q9.6(C) R83.2
N$228: Q8.3(C) R84.2
N$229: Q8.6(C) R85.2
N$230: LED10.C R120.2
N$231: R88.1 U$32.GRN
N$232: R87.1 U$32.BLU
N$233: R86.1 U$32.RED
N$234: Q16.6(C) R86.2
N$235: Q13.3(C) R87.2
N$236: Q13.6(C) R88.2
N$237: R120.1 U$5.13(STATUS)
N$238: Q10.6(B) Q10.7(E) R22.2
N$239: Q20.6(B) Q20.7(E) R24.2
N$240: Q20.3(C) Q20.4(C1) Q20.8(B) R89.2
N$241: Q20.5(E) R24.1 U$2.13(VM2) U$2.14(VM3) U$2.24(VM1)
N$242: Q10.3(C) Q10.4(C1) Q10.8(B) R91.2
N$243: Q10.5(E) R22.1 U$27.13(VM2) U$27.14(VM3) U$27.24(VM1)
N$248: R99.2 U$35.5(EN)
N$249: R95.2 U$36.5(EN)
N$258: C140.1 R56.2 U5.3(X)
N$262: LED4.A R105.2
N$263: LED5.A R54.2
N$264: LED6.A R59.2
N$265: LED7.A R58.2
N$272: R111.1 U$29.5
N$274: C139.1 R112.2 U3.1(X)
N$275: C137.1 R114.2 U4.3(X)
N$276: C136.1 R107.2 U4.1(X)
N$277: R107.1 R108.1 S4.1 S4.2
N$278: R114.1 R115.1 S3.3 S3.4
N$279: R55.2 R56.1 S1.3 S1.4
N$280: C141.1 R117.2 U5.1(X)
N$281: R116.2 R117.1 S2.3 S2.4
N$283: U$31.11(ANT) U$38.2
N$284: C60.2 C146.2 U$38.1
N$286: D6.1 J2.PLUS1(+) J2.PLUS2(+2)
N$292: Q7.11(B) R129.10
N$293: Q7.15(B) R129.12
N$294: Q6.9(B) R129.13
N$297: Q6.15(B) R128.10
N$298: Q5.9(B) R128.11
N$299: Q5.11(B) R128.12
N$300: Q5.13(B) R128.13
N$301: Q5.15(B) R128.14
ORB0_B: R125.2 U6.64(PC7/TIOB1/CFCE2)
ORB0_G: R124.2 U6.7(PA28/TIOA2/ECRS)
ORB0_R: R126.2 U6.3(PA26/TIOA0/ERX3)
ORB1_B: R122.2 U6.63(PC6/TIOB2/CFCE1)
ORB1_G: R119.2 U6.60(PC9/!CS5!/CFCS1/TIOB0)
ORB1_R: R123.2 U6.4(PA27/TIOA1/ERXCK)
PGOOD_1.8V: U$1.11(PGOOD2) U$1.18(TRK/SS3)
PSU_BOOST1: C9.1 D10.2 U$1.1(BOOST1)
PSU_BOOST2: C2.2 D9.2 U$1.27(BOOST2)
PSU_BOOST3: C8.1 D11.2 U$1.32(BOOST3)
PSU_FB1: R11.1 R12.1 U$1.9(FB1)
PSU_FB2: R7.2 R8.1 U$1.22(FB2)
PSU_FB3: R14.2 R16.1 U$1.20(FB3)
PSU_FB4: R5.2 U$1.25(FB4)
PSU_OVLO: C2.1 R1.2 R2.2 U$1.5(OVLO)
PSU_RT/SYNC: R3.2 U$1.13(RT/SYNC)
PSU_SW1: C9.2 D4.2 L1.2 U$1.37(SW1_1) U$1.38(SW1_2)
PSU_SW2: D7.2 L3.1 U$1.28(SW2_1) U$1.29(SW2_2)
PSU_SW3: C8.2 D12.2 L2.2 U$1.33(SW3_1) U$1.34(SW3_2)
PSU_UVLO: R51.1 R52.1 U$1.6(UVLO)
PSU_VC1: C5.2 U$1.7(VC1)
PSU_VC3: C6.2 U$1.19(VC3)
PSU_VINSW: R1.1 R51.2 U$1.4(VINSW)
PWR_EN: U$1.14(RUN1) U$1.15(RUN2) U$1.16(RUN3) U$3.11(EN)
PWR_WDOG: IC1.33(PG0(WR)) U$3.3(WDE)
SDCARD_CLK: U6.189(PA8/MCCK) U$20.5(CLK)
SDCARD_CMD: U6.186(PA7/MCCDA) U$20.3(CMD)
SDCARD_DATA0: U6.185(PA6/MCDA0) U$20.7(DATA0)
SDCARD_DATA1: U6.190(PA9/MCDA1) U$20.8(DATA1)
SDCARD_DATA2: U6.191(PA10/MCDA2/ETX2) U$20.1(DATA2)
SDCARD_DATA3: U6.192(PA11/MCDA3/ETX3) U$20.2(DATA3)
SDRAM_A0: U6.97(A2) U$6.H7(A0)
SDRAM_A1: U6.96(A3) U$6.H8(A1)
SDRAM_A2: U6.95(A4) U$6.J8(A2)
SDRAM_A3: U6.94(A5) U$6.J7(A3)
SDRAM_A4: U6.93(A6) U$6.J3(A4)
SDRAM_A5: U6.92(A7) U$6.J2(A5)
SDRAM_A6: U6.89(A8) U$6.H3(A6)
SDRAM_A7: U6.88(A9) U$6.H2(A7)
SDRAM_A8: U6.87(A10) U$6.H1(A8)
SDRAM_A9: U6.86(A11) U$6.G3(A9)
SDRAM_A10: U6.100(SDA10) U$6.H9(A10)
SDRAM_A11: U6.84(A13) U$6.G2(A11)
SDRAM_A12: U6.83(A14) U$6.G1(A12)
SDRAM_BA0: U6.81(BA0/A16) U$6.G4(BA0)
SDRAM_BA1: U6.80(BA1/A17) U$6.G5(BA1)
SDRAM_CKE: U6.117(SDCKE) U$6.F3(CKE)
SDRAM_CLK: U6.115(SDCK) U$6.F2(CLK)
SDRAM_DATA0: U6.106(D0) U$6.A8(DQ0)
SDRAM_DATA1: U6.107(D1) U$6.B9(DQ1)
SDRAM_DATA2: U6.108(D2) U$6.B8(DQ2)
SDRAM_DATA3: U6.109(D3) U$6.C9(DQ3)
SDRAM_DATA4: U6.110(D4) U$6.C8(DQ4)
SDRAM_DATA5: U6.111(D5) U$6.D9(DQ5)
SDRAM_DATA6: U6.112(D6) U$6.D8(DQ6)
SDRAM_DATA7: U6.118(D7) U$6.E9(DQ7)
SDRAM_DATA8: U6.119(D8) U$6.E1(DQ8)
SDRAM_DATA9: U6.120(D9) U$6.D2(DQ9)
SDRAM_DATA10: U6.121(D10) U$6.D1(DQ10)
SDRAM_DATA11: U6.122(D11) U$6.C2(DQ11)
SDRAM_DATA12: U6.123(D12) U$6.C1(DQ12)
SDRAM_DATA13: U6.124(D13) U$6.B2(DQ13)
SDRAM_DATA14: U6.125(D14) U$6.B1(DQ14)
SDRAM_DATA15: U6.126(D15) U$6.A2(DQ15)
SDRAM_LDQM: U6.99(!BS0!/A0) U$6.E8(LDQM)
SDRAM_UDQM: U6.102(CFIOR/!BS1!/!WR1!) U$6.F1(UDQ)
SONAR_RX: IC1.28((TXD1/INT3)PD3) J3.13
SONAR_TX: IC1.27((RXD1/INT2)PD2) J3.12
STEP_1A: J3.16 U$33.24(OUT1A)
STEP_1B: J3.15 U$33.21(OUT1B)
STEP_2A: J3.17 U$33.26(OUT2A)
STEP_2B: J3.18 U$33.1(OUT2B)
STEP_DIR: IC1.30((XCK1)PD5) U$33.19(DIR)
STEP_STEP: IC1.29((IC1)PD4) U$33.16(STEP)
USB_DEV_D+: U6.55(DDP) X1.3
USB_DEV_D-: U6.54(DDM) X1.2
USB_HOST_D+: J5.2(D-) U6.51(HDPA)
USB_HOST_D-: J5.3(D+) U6.50(HDMA)
USR_BUT_0: IC1.17((OC2/OC1C)PB7) U4.4(Y)
USR_BUT_1: IC1.14((OC0)PB4) U4.6(Y)
VBATT: C45.1 F1.2 R6.1 R41.1 R59.1 U$3.15(V1) U$5.14(BATT) U$11.1(D) U$11.2(D$1) U$11.3(D$2) U$11.6(D$3) U$11.7(D$4) U$11.8(D$5) U$23.3(VIN)
VBATT_GATE: U$3.16(G1) U$10.4(G) U$11.4(G)
VBATT_PRE_FUSE: F1.1 Q18.4(S)
VBATT_RAW: Q18.1(D) Q18.2(D2) Q18.5(D3) Q18.6(D4) SV3.2
VCC: C1.1 C15.1 C16.1 Q10.1(C) Q10.2(C1) Q20.1(C) Q20.2(C1) R4.2 R89.1 R91.1 SV1.4 U$1.2(VIN1_1) U$1.3(VIN1_2) U$1.30(VIN2_1) U$1.31(VIN2_2) U$1.35(VIN3_1) U$1.36(VIN3_2) U$3.14(VS) U$9.5(S) U$10.1(D) U$10.2(D$1) U$10.3(D$2) U$10.6(D$3) U$10.7(D$4) U$10.8(D$5)
VCHARGE: Q19.1(D) Q19.2(D2) Q19.5(D3) Q19.6(D4) R58.1 SV3.4
VCHARGE_GATE: R21.1 U$4.4(STAT) U$12.4(G)
VCHARGE_SAFE: C22.1 Q19.4(S) U$5.2(DCIN) U$12.1(D) U$12.2(D$1) U$12.3(D$2) U$12.6(D$3) U$12.7(D$4) U$12.8(D$5) U$19.7(D) U$19.8($D1)
VUSB: L5.1 R54.1 U$4.1(VIN) U$8.1(D) U$8.2(D$1) U$8.3(D$2) U$8.6(D$3) U$8.7(D$4) U$8.8(D$5)
VUSB_GATE: U$4.5(GATE) U$8.4(G)
WL_BIAS: R65.1 U$31.15(BIAS)
WL_EN: U6.168(PB25/RI0/ISI_D5) U$31.5(PAEN) U$31.6(EN)
WL_HGM: U6.167(PB24/DTR0/ISI_D4) U$31.7(HGM)
WL_IRQ: U6.127(PC15/!WAIT!/IRQ1) U$30.24(IRQ)
WL_RF+: U$30.4(RFP) U$31.4(RF_P)
WL_RF-: U$30.5(RFN) U$31.2(RF_N)
WL_RXTX: U$30.1(DIG3) U$31.3(RXTX)
WL_SLP_TR: U6.166(PB23/DCD0/ISI_D3) U$30.11(SLP_TR)
WL_XTAL1: C70.1 Q4.1 U$30.26(XTAL1)
WL_XTAL2: C71.1 Q4.3 U$30.25(XTAL2)
Unconnected: IC1.1(PEN) IC1.10((SS)PB0) IC1.12((MOSI)PB2) IC1.13((MISO)PB3) IC1.31((T1)PD6) IC1.32((T2)PD7) J4.16 J4.17 Q3.2(GND) Q3.4(GND1) Q4.2(GND) Q4.4(GND1) Q9.2(B) Q9.3(C) Q9.4(E) Q11.2(GND) Q11.4(GND1) Q16.2(B) Q16.3(C) Q16.4(E) R127.7 R128.7 R128.8 R129.7 R129.8 SV1.3 SV2.7 U2.3(NC) U2.8(INT1) U2.9(INT2) U2.11(N/C) U6.8(PA29/SCK1/ECOL) U6.9(PB0/SPI1_MISO/TIOA3) U6.10(PB1/SPI1_MOSI/TIOB3) U6.11(PB2/SPI1_SPCK/TIOA4) U6.12(PB3/SPI1_!PCS0) U6.19(PB8/TXD2) U6.20(PB9/RXD2) U6.23(PB16/TK0/TCLK3) U6.26(PB17/TF0/TCLK4) U6.27(PB18/TD0/TIOB4) U6.28(PB19/RD0/TIOB5) U6.37(RTCK) U6.42(TST) U6.43(JTAGSEL) U6.48(WKUP) U6.49(SHDN) U6.58(PC10/A25/CFRNW/CTS3) U6.59(PC14/!CS3!/NANDCS/IRQ2) U6.61(PC8/!CS4!/CFCS0/RTS3) U6.62(PC4/A23/SPI1_!PCS2) U6.67(PC5/A24/SPI1_!PCS1) U6.68(!CS0) U6.69(CFOE/!RD) U6.70(CFWE/!WE/!WR0) U6.71(NANDOE) U6.72(NANDWE) U6.73(A22) U6.74(A21) U6.75(A20) U6.76(A19) U6.79(A18) U6.82(A15) U6.85(A12) U6.98(!WR2!/!BS2!/A1) U6.101(CFIOW/!BS3!/!WR3) U6.129(PC17/D17/SPI0_!PCS3) U6.130(PC18/D18/SPI1_!PCS1) U6.131(PC19/D19/SPI1_!PCS2) U6.159(PC1/PCK0/AD1) U6.161(PB10/TXD3/ISI_D8) U6.162(PB11/RXD3/ISI_D9) U6.163(PB20/RK0/ISI_D0) U6.164(PB21/RF0/ISI_D1) U6.175(PB28/RTS1/ISI_PCK) U6.176(PB29/CTS1/ISI_VSYNC) U6.177(PB30/PCK0/ISI_HSYNC) U6.178(PB31/PCK1) U6.207(PA22/ADTRG/ETXER) U$1.8(TRK/SS1) U$1.10(PGOOD1) U$1.12(PGOOD3) U$1.21(TRK/SS2) U$1.24(DRIVE) U$1.26(TRK/SS4) U$21.2(TX_CLK) U$21.6(TXD2) U$21.7(TXD3) U$21.27(X2) U$21.31(RX_CLK) U$21.35(COL/PHYAD0) U$21.38(RXD2/PHYAD3) U$21.39(RXD3/PHYAD4) U$26.1(AIN1) U$26.2(AIN0) U$26.8(VOUT) U$30.2(DIG4) U$30.9(DIG1) U$30.10(DIG2) U$30.17(CLKM)

## Buses
SDRAM_A[0..12],SDRAM_BA0,SDRAM_BA1
SDRAM_DATA[0..15],SDRAM_UDQM,SDRAM_LDQM
SDRAM_CKE,!SDRAM_WE,SDRAM_CLK,!SDRAM_CS,!SDRAM_CAS,!SDRAM_RAS

## Notes on the sheet
- ceramic, x5r or x7r
- output caps can be ceramic, x5r, x7r, or tantalum
- 10uF is a tantalum cap
- Tantalum
- 12 mils between each trace, 8mils min
- Decoupling cap combined with other motor driver
- This should be about 1.8V after the diode drops
- 3V Coin Cell, ~25mA

## Library data of the parts
A1 = kwoo:ANT-2.4-CHP
C1 C2 C5 C6 C8 C9 C12 C15-C17 C19-C31 C33-C40 C45-C47 C52-C81 C83 C85-C87 C95 C97-C103 C105-C112 C117-C120 C132 C133 C136-C141 C143-C146 = SparkFun:CAP: Capacitor Standard 0603 ceramic capacitor, and 0.1" leaded capacitor.
C3 C10 C18 C32 C48 C49 C82 C121-C126 C129 C130 = rcl:C-EU: CAPACITOR, European symbol
D1 D9-D11 = kwoo:1N41482
D2 = kwoo:DIODE
D3 D4 D7 D8 D12 = kwoo:MBRS340
D6 = kwoo:BAS69KFILM
F1 = kwoo:MF-SM200
IC1 = atmel:MEGA128: MICROCONTROLLER 128 Kbytes FLASH 4 Kbytes SRAM 4 Kbytes EEPROM DUAL USART 8-channel 10 bit ADC Source: avr.lbr
J1 = kwoo:RJ45_PULSE
J2 = kwoo:KEYSTONE_3000
J3 J4 = kwoo:XF2L
J5 = kwoo:USB_A
JP1 = SparkFun:M04: Header 4 Standard 4-pin 0.1" header. Use with straight break away headers (SKU : PRT-00116), right angle break away headers (PRT-00553), swiss pins (PRT-00743), machine pins (PRT-00117), and female headers (PRT-00115). Molex polarized connector foot print use with SKU : PRT-08231 with associated crimp pins and housings.
JP2 JP6 = SparkFun:JUMPER-3
JP3 JP7-JP9 = SparkFun:M03: Header 3 Standard 3-pin 0.1" header. Use with straight break away headers (SKU : PRT-00116), right angle break away headers (PRT-00553), swiss pins (PRT-00743), machine pins (PRT-00117), and female headers (PRT-00115). Molex polarized connector foot print use with SKU : PRT-08232 with associated crimp pins and housings.
JP4 JP5 = SparkFun:JUMPER-2: Jumper Basic 0.1" spaced jumper. Use with breakaway headers.
JP10-JP14 = SparkFun:STAND-OFF: Stand Off This is the mechanical footprint for a #4 phillips button head screw. Use the keepout ring to avoid running the screw head into surrounding components. SKU : PRT-00447
L1 L2 = kwoo:DR74-XXX-R
L3 = kwoo:NR6045TXXX
L5 = kwoo:MI0805K400R-10
L6 = kwoo:DR125-XXX-R
LED4-LED7 LED10-LED24 = SparkFun:LED: LEDs Standard schematic elements and footprints for 5mm, 3mm, 1206, and 0603 sized LEDs. 5mm - Spark Fun Electronics SKU : COM-00529 (and others)
Q2 = kwoo:ECX-31B
Q3 Q4 Q11 = kwoo:NX3225SA
Q5-Q7 = kwoo:MMPQ3904
Q8 Q9 Q13 Q16 = kwoo:DMMT3906W
Q10 Q20 = kwoo:ZDT1053
Q18 = kwoo:DMP266LDM
Q19 = kwoo:SI3493BDV
R1-R5 R7-R21 R23 R25 R26 R29-R36 R40 R41 R46-R52 R54-R72 R83-R89 R91 R93-R95 R99 R105-R117 R119-R126 = resistor:R-US_: RESISTOR, American symbol
R6 R39 = SparkFun:RESISTOR: Resistor Basic schematic elements and footprints for 0603, 1206, and PTH 1/10th watt (small) resistors.
R22 R24 = rcl:R-US_: RESISTOR, American symbol
R127 = kwoo:RESNET_BUS_13
R128 R129 = kwoo:RESNET_ISO_7
S1-S5 = SparkFun:TAC_SWITCH: Momentary Switch Button commonly used for reset or general input. Spark Fun Electronics SKU : COM-00097
SV1 = kwoo:MA06-2W: PIN HEADER
SV2 = con-lstb:MA05-2: PIN HEADER
SV3 = kwoo:MA02-2W
SV4 = con-lstb:MA04-2: PIN HEADER
SV5 = con-lstb:MA03-1: PIN HEADER
U2 = SparkFun:ADXL345
U3-U5 = kwoo:NL27WZ14
U6 = kwoo:AT91SAM9260
U7 = kwoo:AT45DB321D
U$1 = kwoo:LT3507
U$2 U$27 = kwoo:TB6612FNG
U$3 = kwoo:LTC2952
U$4 = kwoo:LTC4412
U$5 = kwoo:MAX745
U$6 = kwoo:MT48H32M16LF
U$7 = rc:ROBOLOGO
U$8-U$12 = kwoo:SI5401DC
U$19 = kwoo:IRF7303
U$20 = kwoo:MICRO-SD
U$21 = kwoo:DP83848J
U$23 = kwoo:MCP1702
U$26 = kwoo:DS2786
U$28 = SparkFun:LISY300AL: Untested part for LIS300AL.
U$29 = SparkFun:AVR_SPI_PRG_6: AVR ISP 6 Pin This is the reduced ISP connector for AVR programming. Common on Arduino. This footprint will take up less PCB space and can be used with a 10-pin to 6-pin adapter such as SKU: BOB-08508
U$30 = kwoo:AT86RF231
U$31 = kwoo:CC2591
U$32 U$34 = SparkFun:LED-TRICOLOR-THROUGHHOLE
U$33 = kwoo:A4983
U$35 U$36 = kwoo:PCA9306
U$38 = SparkFun:INDUCTOR: Inductors Basic Inductor/Choke - 0603 and 1206. Footprints are not proven and vary greatly between part numbers.
X1 = con-hirose:MINI-USB-: MINI USB Connector Source: http://www.hirose.co.jp/cataloge_hp/e24000019.pdf
X2 = kwoo:K25-3C